# Altium project WiCL.PrjPCB
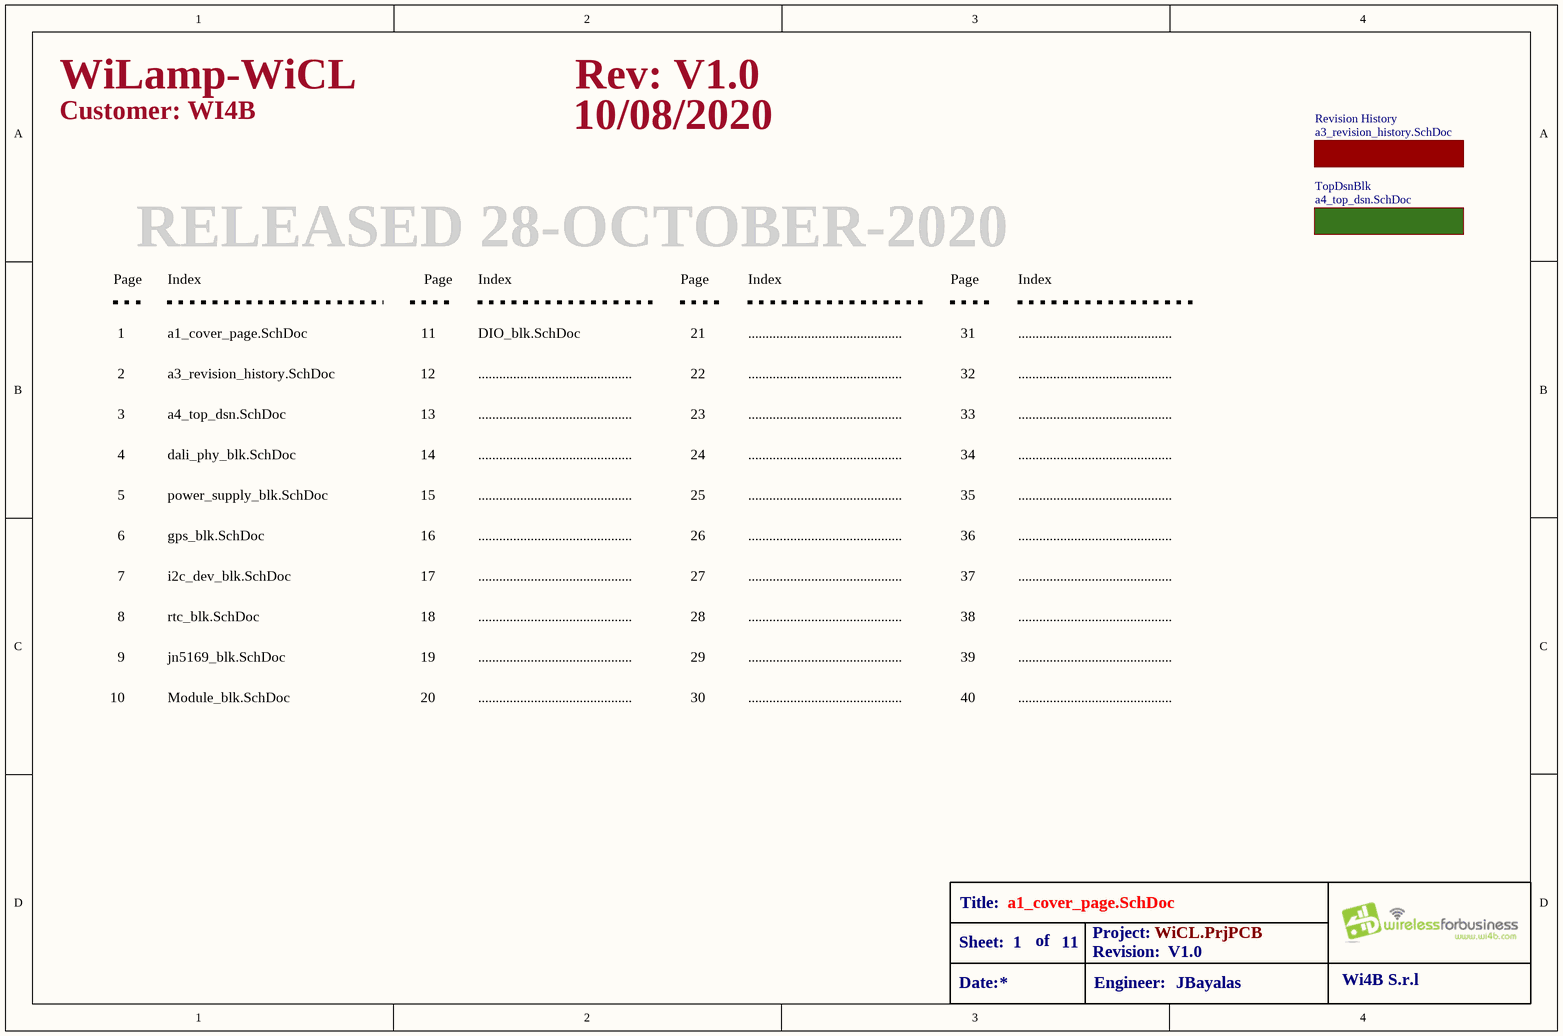
[diagram p0: a1_cover_page.SchDoc]
Engineer: AAsodisen; Revision: V1.0
11 sheets, 143 parts. Net scope: hierarchical (ports join the sheet entries above them; power ports are global).
Board file: WiCL.PcbDoc
Sheets:
  a1_cover_page.SchDoc
    TopDsnBlk = a4_top_dsn.SchDoc
      DALI_PHY = dali_phy_blk.SchDoc
      PSU = power_supply_blk.SchDoc
      I2C Devs = i2c_dev_blk.SchDoc
      GPS = gps_blk.SchDoc
      JENIC = jn5169_blk.SchDoc
        Module_blk = Module_blk.SchDoc
      RTC = rtc_blk.SchDoc
      Digital = DIO_blk.SchDoc
    Revision History = a3_revision_history.SchDoc

## Sheet a1_cover_page.SchDoc
size A4; Date: 1/11/16; CompanyName: AMTI; Engineer: JBayalas; DocumentNumber: 1; Revision: V1.0; SheetNumber: 1; SheetTotal: 11

### Sub-sheets
Revision History = a3_revision_history.SchDoc: no entries
TopDsnBlk = a4_top_dsn.SchDoc: no entries

### Notes on the sheet
- WiLamp-WiCL
- Rev: V1.0
- Customer: WI4B
- 10/08/2020
- Page
- Index
- RELEASED 28-OCTOBER-2020
- 1
- 2
- a1_cover_page.SchDoc
- a3_revision_history.SchDoc
- 11
- 12
- ............................................
- DIO_blk.SchDoc
- 21
- 22
- 31
- 32
- 3
- a4_top_dsn.SchDoc
- 13
- 23
- 33
- 4
- 5
- dali_phy_blk.SchDoc
- power_supply_blk.SchDoc
- 14
- 15
- 24
- 25
- 34
- 35
- 6
- 7
- i2c_dev_blk.SchDoc
- gps_blk.SchDoc
- 16
- 17
- 26
- 27
- 36
- 37
- 8
- rtc_blk.SchDoc
- 18
- 28
- 38
- 9
- 10
- jn5169_blk.SchDoc
- Module_blk.SchDoc
- 19
- 20
- 29
- 30
- 39
- 40
- Title:
- Sheet:
- Date:
- of
- Project:
- Revision:
- Engineer:
- Wi4B S.r.l

## Sheet a4_top_dsn.SchDoc
size A4; Date: 1/11/16; Engineer: JBayalas; DocumentNumber: 3; Revision: V1.0; SheetNumber: 3; SheetTotal: 11
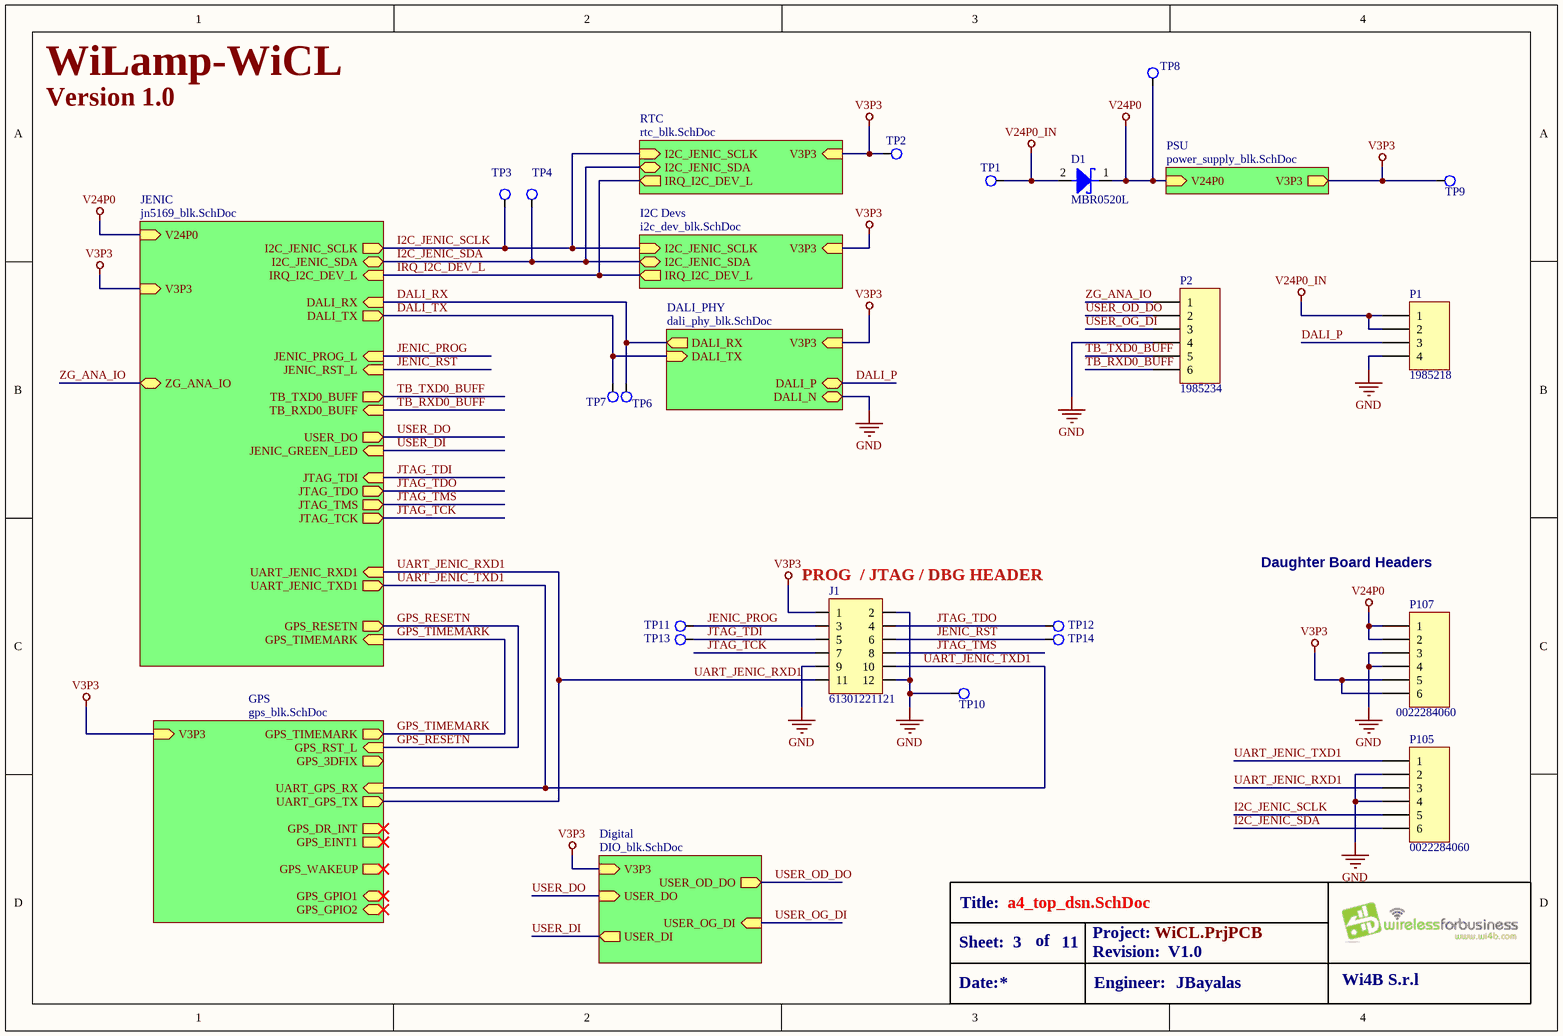
[diagram p1: a4_top_dsn.SchDoc]

### Parts
D1  MBR0520L  [SOD123]
J1  value 61301221121  [61301221121]  (hidden comment: *)
P1  1985218  [1985218 (4pin)]
P2  1985234  [1985234 (6 PIN)]
P105  0022284060  [HDR1X6]
P107  0022284060  [HDR1X6]
TP1  Test Point_2mm  [Test Point 2mm]  (value not drawn)
TP2  Test Point_2mm  [Test Point 2mm]  (value not drawn)
TP3  Test Point_2mm  [Test Point 2mm]  (value not drawn)
TP4  Test Point_2mm  [Test Point 2mm]  (value not drawn)
TP6  Test Point_2mm  [Test Point 2mm]  (value not drawn)
TP7  Test Point_2mm  [Test Point 2mm]  (value not drawn)
TP8  Test Point_3mm  [Test Point 3mm]  (value not drawn)
TP9  Test Point_3mm  [Test Point 3mm]  (value not drawn)
TP10  Test Point_3mm  [Test Point 3mm]  (value not drawn)
TP11  Test Point_3mm  [Test Point 3mm]  (value not drawn)
TP12  Test Point_3mm  [Test Point 3mm]  (value not drawn)
TP13  Test Point_3mm  [Test Point 3mm]  (value not drawn)
TP14  Test Point_3mm  [Test Point 3mm]  (value not drawn)

### Sub-sheets
DALI_PHY = dali_phy_blk.SchDoc: V3P3 (in), DALI_TX (in), DALI_RX (out), DALI_P (bidir), DALI_N (bidir)
Digital = DIO_blk.SchDoc: USER_DO (in), V3P3 (in), USER_DI (out), USER_OD_DO (out), USER_OG_DI (in)
GPS = gps_blk.SchDoc: UART_GPS_TX (out), UART_GPS_RX (in), V3P3 (in), GPS_RST_L (in), GPS_DR_INT (out), GPS_EINT1 (out), GPS_3DFIX (out), GPS_TIMEMARK (out), GPS_WAKEUP (out), GPS_GPIO1 (bidir), GPS_GPIO2 (bidir)
I2C Devs = i2c_dev_blk.SchDoc: I2C_JENIC_SDA (bidir), I2C_JENIC_SCLK (in), V3P3 (in), IRQ_I2C_DEV_L (out)
JENIC = jn5169_blk.SchDoc: V3P3 (in), JENIC_PROG_L (in), UART_JENIC_TXD1 (out), UART_JENIC_RXD1 (in), I2C_JENIC_SDA (bidir), I2C_JENIC_SCLK (out), ZG_ANA_IO (bidir), IRQ_I2C_DEV_L (in), GPS_RESETN (out), GPS_TIMEMARK (in), JENIC_RST_L (in), V24P0 (in), DALI_RX (in), DALI_TX (out), JTAG_TDI (in), JTAG_TDO (out), JTAG_TMS (out), JTAG_TCK (out), TB_RXD0_BUFF (in), TB_TXD0_BUFF (out), JENIC_GREEN_LED (in), USER_DO (out)
PSU = power_supply_blk.SchDoc: V3P3 (out), V24P0 (in)
RTC = rtc_blk.SchDoc: V3P3 (in), I2C_JENIC_SCLK (in), I2C_JENIC_SDA (bidir), IRQ_I2C_DEV_L (out)

### Nets
GND: J1.2 J1.9 J1.12 P1.4 P2.4 P105.2 P105.4 P107.3 P107.4 TP10.1 ; sheet DALI_PHY/DALI_N
V3P3: J1.1 P107.5 P107.6 TP2.1 TP9.1 ; sheet DALI_PHY/V3P3, sheet PSU/V3P3, sheet I2C Devs/V3P3, sheet GPS/V3P3, sheet JENIC/V3P3, sheet RTC/V3P3, sheet Digital/V3P3
V24P0: D1.1(cathode) P107.1 P107.2 TP8.1 ; sheet PSU/V24P0, sheet JENIC/V24P0
V24P0_IN: D1.2(anode) P1.1 P1.2 TP1.1
DALI_P: P1.3 ; sheet DALI_PHY/DALI_P
DALI_RX: TP6.1 ; sheet DALI_PHY/DALI_RX, sheet JENIC/DALI_RX
DALI_TX: TP7.1 ; sheet DALI_PHY/DALI_TX, sheet JENIC/DALI_TX
GPS_RESETN: sheet GPS/GPS_RST_L, sheet JENIC/GPS_RESETN
GPS_TIMEMARK: sheet GPS/GPS_TIMEMARK, sheet JENIC/GPS_TIMEMARK
I2C_JENIC_SCLK: P105.5 TP3.1 ; sheet I2C Devs/I2C_JENIC_SCLK, sheet JENIC/I2C_JENIC_SCLK, sheet RTC/I2C_JENIC_SCLK
I2C_JENIC_SDA: P105.6 TP4.1 ; sheet I2C Devs/I2C_JENIC_SDA, sheet JENIC/I2C_JENIC_SDA, sheet RTC/I2C_JENIC_SDA
IRQ_I2C_DEV_L: sheet I2C Devs/IRQ_I2C_DEV_L, sheet JENIC/IRQ_I2C_DEV_L, sheet RTC/IRQ_I2C_DEV_L
JENIC_PROG: J1.3 TP11.1 ; sheet JENIC/JENIC_PROG_L
JENIC_RST: J1.6 TP14.1 ; sheet JENIC/JENIC_RST_L
JTAG_TCK: J1.7 ; sheet JENIC/JTAG_TCK
JTAG_TDI: J1.5 TP13.1 ; sheet JENIC/JTAG_TDI
JTAG_TDO: J1.4 TP12.1 ; sheet JENIC/JTAG_TDO
JTAG_TMS: J1.8 ; sheet JENIC/JTAG_TMS
TB_RXD0_BUFF: P2.6 ; sheet JENIC/TB_RXD0_BUFF
TB_TXD0_BUFF: P2.5 ; sheet JENIC/TB_TXD0_BUFF
UART_JENIC_RXD1: J1.11 P105.3 ; sheet GPS/UART_GPS_TX, sheet JENIC/UART_JENIC_RXD1
UART_JENIC_TXD1: J1.10 P105.1 ; sheet GPS/UART_GPS_RX, sheet JENIC/UART_JENIC_TXD1
USER_DI: sheet JENIC/JENIC_GREEN_LED, sheet Digital/USER_DI
USER_DO: sheet JENIC/USER_DO, sheet Digital/USER_DO
USER_OD_DO: P2.2 ; sheet Digital/USER_OD_DO
USER_OG_DI: P2.3 ; sheet Digital/USER_OG_DI
ZG_ANA_IO: P2.1 ; sheet JENIC/ZG_ANA_IO

### Notes on the sheet
- Version 1.0
- WiLamp-WiCL
- (near J1) PROG  / JTAG / DBG HEADER
- Daughter Board Headers
- Title:
- Sheet:
- Date:
- of
- Project:
- Revision:
- Engineer:
- Wi4B S.r.l

### Library data of the parts
D1 = MBR0520L: DIODE SCHOTTKY 20V 0.5A SOD123; Manufacturer: Fairchild Semiconductor; Current - Average Rectified (Io): 500mA; Voltage - Forward (Vf) (Max) @ If: 385mV @ 500mA; Speed: Fast Recovery =< 500ns, > 200mA (Io); Current - Reverse Leakage @ Vr: 250µA @ 20V; Capacitance: 2.2µF; Tolerance: ±20%; Voltage - Rated: 100V; Temperature Coefficient: X7S; Supplier 1: Digi-Key; RoHS: RoHS Compliant; Category: Discrete Semiconductor Products; Stock 1: 251227; Pricing 1: 1=0.26, 10=0.232, 25=0.1668, 100=0.1297, 250=0.08152, 500=0.06946, 1000=0.04732 (GBP); Packaging: Cut Tape (CT); Diode Type: Schottky; Voltage - DC Reverse (Vr) (Max): 20V; Reverse Recovery Time (trr): -; Capacitance @ Vr, F: -; Mounting Type: Surface Mount; Package / Case: SOD-123; Supplier Device Package: SOD-123; Operating Temperature - Junction: -65°C ~ 125°C; ComponentLink1URL: http://www.fairchildsemi.com/datasheets/MB/MBR0520L.pdf; ComponentLink1Description: http://www.fairchildsemi.com/datasheets/MB/MBR0520L.pdf; Supplier Part Number 1: MBR0520LCT-ND; Supplier 2: Digi-Key; Stock 2: 9462; Pricing 2: 1=0.84, 10=0.804, 100=0.39, 250=0.324, 500=0.294, 1000=0.27 (USD); Operating Temperature: -55°C ~ 125°C; Applications: Automotive; Ratings: AEC-Q200; Size / Dimension: 0.126" L x 0.063" W (3.20mm x 1.60mm); Height - Seated (Max): -; Thickness (Max): 0.071" (1.80mm); Lead Spacing: -; Features: -; Lead Style: -; ComponentLink2URL: https://product.tdk.com/info/en/catalog/datasheets/mlcc_automotive_midvoltage_en.pdf; ComponentLink2Description: https://product.tdk.com/info/en/catalog/datasheets/mlcc_automotive_midvoltage_en.pdf; Manufacturer Part Number: MBR0520L
J1 = 61301221121: CONN HEADER VERT 12POS 2.54MM; MFT: Wurth Electronics; MPN: 61301221121; TYPE: TH; RATING: *; LOAD: *
P1 = 1985218: Fixed Terminal Blocks PTSA 1.5/4-3.5-Z; MFT: Phoenix Contact; TYPE: Through Hole; VALUE: 1985218; MPN: 1985218
P2 = 1985234: TERM BLOCK PCB 6POS 3.5MM GREEN; MFT: Phoenix Contact; TYPE: Through Hole; VALUE: 1985234; MPN: 1985234
P105 P107 = 0022284060: CONN HEADER 6POS .100 VERT TIN; MFT: Molex Inc; FUNCTION: TOP; TYPE: TH; VALUE: 0022284060; RATING: *; LOAD: *; MPN: 0022284060
TP1-TP4 TP6 TP7 = Test Point_2mm: Test Point 2mm
TP8-TP14 = Test Point_3mm: Test Point 3mm

## Sheet dali_phy_blk.SchDoc
size A4; Engineer: JBayalas; DocumentNumber: 4; Revision: V1.0; SheetNumber: 4; SheetTotal: 11; Rule: PcbType=ProtelPcb
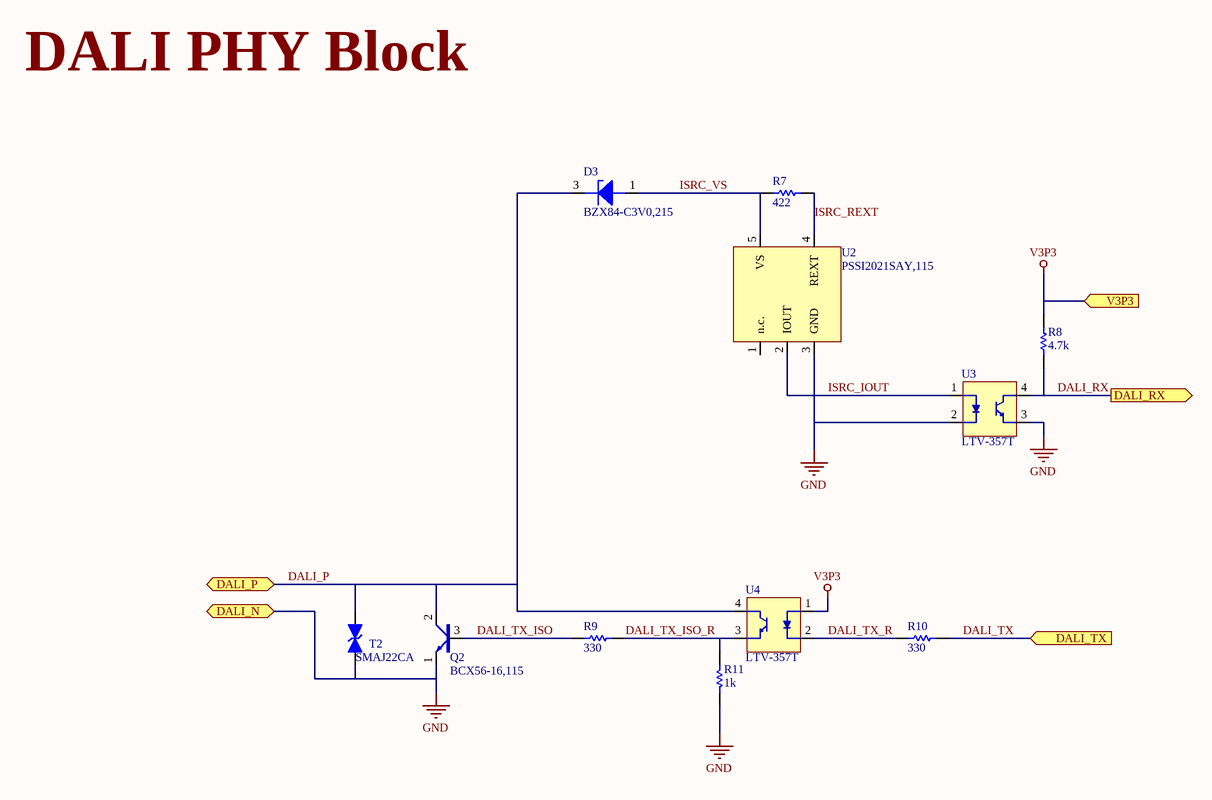
[diagram p2: dali_phy_blk.SchDoc]

### Parts
D3  BZX84-C3V0,215  [SOT-23(TO-236AB)]
Q2  BCX56-16,115  [SOT 89-3]
R7  value 422  [R0402]  (hidden comment: ERJ-2RKF4220X)
R8  value 4.7k  [R0402]  (hidden comment: RT0402FRE074K7L)
R9  value 330  [R0402]  (hidden comment: CRCW0402330RFKED)
R10  value 330  [R0402]  (hidden comment: CRCW0402330RFKED)
R11  value 1k  [R0402]  (hidden comment: MCS04020C1001FE000)
T2  SMAJ22CA  [DO-214AC]
U2  PSSI2021SAY,115  [SOT353]
U3  LTV-357T  [4SMD(gull wing)]
U4  LTV-357T  [4SMD(gull wing)]

### Ports
DALI_N (bidir), DALI_P (bidir), DALI_RX (out), DALI_TX (in), V3P3 (in)

### Nets
GND: Q2.1(emitter) R11.1 T2.2(K) U2.3(GND) U3.2(Cathode) U3.3(Emitter) ; port DALI_N
V3P3: R8.2 U4.1(Anode) ; port V3P3
DALI_P: D3.3(K) Q2.2(collector) T2.1(A) U4.4(Collector) ; port DALI_P
DALI_RX: R8.1 U3.4(Collector) ; port DALI_RX
DALI_TX: R10.2 ; port DALI_TX
DALI_TX_ISO: Q2.3(base) R9.1
DALI_TX_ISO_R: R9.2 R11.2 U4.3(Emitter)
DALI_TX_R: R10.1 U4.2(Cathode)
ISRC_IOUT: U2.2(IOUT) U3.1(Anode)
ISRC_REXT: R7.2 U2.4(REXT)
ISRC_VS: D3.1(A) R7.1 U2.5(VS)

Not connected (* = marked no-connect by the designer): U2 1(n.c.)

### Notes on the sheet
- DALI PHY Block
- Title:
- Sheet:
- Date:
- of
- Project:
- Revision:
- Engineer:
- Wi4B S.r.l

### Library data of the parts
D3 = BZX84-C3V0,215: DIODE ZENER 3V 250MW TO236AB; Manufacturer: NXP Semiconductors; Tolerance: ±5%; Impedance (Max) (Zzt): 95 Ohm; Current - Reverse Leakage @ Vr: 10µA @ 1V; Voltage - Forward (Vf) (Max) @ If: 900mV @ 10mA; Supplier 1: Digi-Key; RoHS: RoHS Compliant; Category: Discrete Semiconductor Products; Stock 1: 18717; Pricing 1: 1=0.16, 10=0.149, 25=0.1352, 100=0.0973, 250=0.05732, 500=0.04756, 1000=0.03245 (USD); Packaging: Cut Tape (CT); Voltage - Zener (Nom) (Vz): 3V; Power - Max: 250mW; Operating Temperature: -65°C ~ 150°C; Mounting Type: Surface Mount; Package / Case: TO-236-3, SC-59, SOT-23-3; Supplier Device Package: SOT-23 (TO-236AB); ComponentLink1URL: http://www.nxp.com/documents/data_sheet/BZX84_SER.pdf; ComponentLink1Description: http://www.nxp.com/documents/data_sheet/BZX84_SER.pdf; Supplier Part Number 1: 568-6326-1-ND; Manufacturer Part Number: BZX84-C3V0,215
Q2 = BCX56-16,115: TRANS NPN MED 1A 80V SOT89; Manufacturer: NXP Semiconductors; Vce Saturation (Max) @ Ib, Ic: 500mV @ 50mA, 500mA; DC Current Gain (hFE) (Min) @ Ic, Vce: 100 @ 150mA, 2V; Power - Max: 1.25W; Frequency - Transition: 180MHz; Supplier 1: Digi-Key; RoHS: RoHS Compliant; Category: Discrete Semiconductor Products; Stock 1: 23673; Pricing 1: 1=0.58, 10=0.406, 25=0.3332, 100=0.2664, 250=0.19404, 500=0.15758 (USD); Packaging: Cut Tape (CT); Transistor Type: NPN; Current - Collector (Ic) (Max): 1A; Voltage - Collector Emitter Breakdown (Max): 80V; Current - Collector Cutoff (Max): -; Mounting Type: Surface Mount; Package / Case: TO-243AA; Supplier Device Package: SOT-89-3; ComponentLink1URL: http://media.digikey.com/pdf/Data%20Sheets/NXP%20PDFs/BC639,BCP56,BCX56.pdf; ComponentLink1Description: http://media.digikey.com/pdf/Data%20Sheets/NXP%20PDFs/BC639,BCP56,BCX56.pdf; Supplier Part Number 1: 568-1642-1-ND; Manufacturer Part Number: BCX56-16,115
R7 = ERJ-2RKF4220X: RES SMD 422 OHM 1% 1/10W 0402; MFT: Panasonic Electronic Components; MPN: ERJ-2RKF4220X; TYPE: SMD; LOAD: *; RATING: 1/10W; APN: *
R8 = RT0402FRE074K7L: RES SMD 4.7K OHM 1% 1/16W 0402; MFT: Yageo; MPN: RT0402FRE074K7L; TYPE: SMD; LOAD: *; RATING: 1/16W; APN: *
R9 R10 = CRCW0402330RFKED: RES SMD 330 OHM 1% 1/16W 0402; MFT: Vishay Dale; MPN: CRCW0402330RFKED; TYPE: SMD; RATING: 1/16W; DNP: *
R11 = MCS04020C1001FE000: RES SMD 1K OHM 1% 1/10W 0402; MFT: Vishay Beyschlag; MPN: MCS04020C1001FE000; TYPE: SMD; RATING: 1/10W; DNP: *
T2 = SMAJ22CA: TVS Diodes - Transient Voltage Suppressors 22Vr 400W 11.3A 5% BiDirectional; MFT: Littelfuse; TYPE: SMD/SMT; RATING: 22 V; VALUE: SMAJ22CA; MPN: SMAJ22CA
U2 = PSSI2021SAY,115: NXP - PSSI2021SAY,115 - IC, CURRENT REGULATOR, 75V, 50MA, 5-SOT-353, FULL REEL; Power Dissipation Pd: 335; No. of Pins: 5; Supplier 1: Newark; Manufacturer: NXP; RoHS: YES; Stock 1: 3000; Pricing 1: 3000=0.233, 6000=0.216, 15000=0.209, 30000=0.201, 75000=0.197, 150000=0.192 (USD); Forward Current If: -; Forward Voltage: -; Forward Current If(AV): -; Current Regulator Case Style: SOT-353; Packaging: Tape & Reel; ComponentLink1URL: http://www.farnell.com/datasheets/667515.pdf; ComponentLink1Description: http://www.farnell.com/datasheets/667515.pdf; Supplier Part Number 1: 70R7980; Manufacturer Part Number: PSSI2021SAY,115
U3 U4 = LTV-357T: OPTOISOLATOR 3.75KV TRANS 4-SOP; MFT: Lite-On Inc.; TYPE: SMD; RATING: 3.75KV; VALUE: LTV-357T; LOAD: *; MPN: LTV-357T

## Sheet power_supply_blk.SchDoc
size A4; Date: 1/11/2016; Engineer: JBayalas; DocumentNumber: 5; Revision: V1.0; SheetNumber: 5; SheetTotal: 11
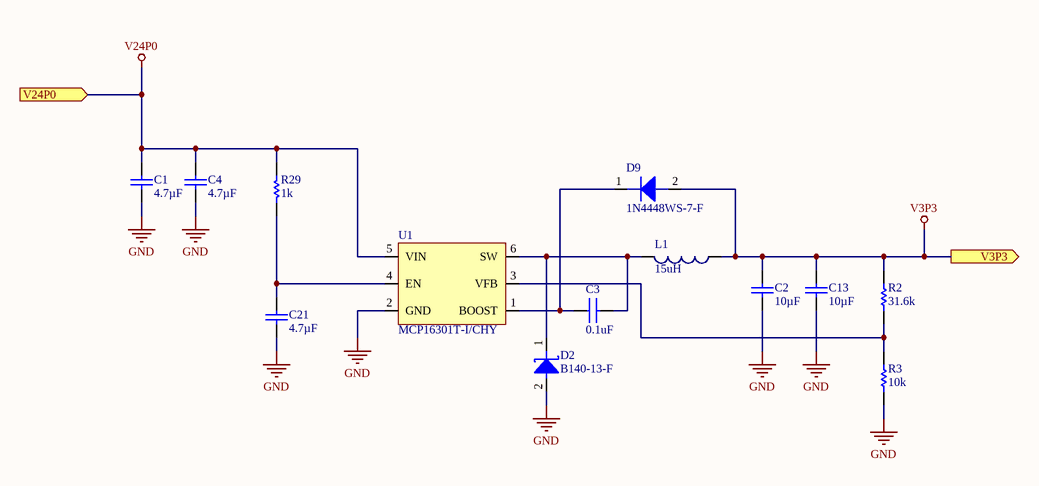
[diagram p3: power_supply_blk.SchDoc]

### Parts
C1  value 4.7µF  [C1210]  (hidden comment: *)
C2  value 10µF  [C0805]  (hidden comment: *)
C3  value 0.1uF  [C0603]  (hidden comment: *)
C4  value 4.7µF  [C1210]  (hidden comment: *)
C13  value 10µF  [C0805]  (hidden comment: *)
C21  value 4.7µF  [C1210]  (hidden comment: *)
D2  value B140-13-F  [DO-214AC, SMA]  (hidden comment: *)
D9  1N4448WS-7-F  [SOD-323]
L1  value 15uH  [MSS6132-153MLC]  (hidden comment: *)
R2  value 31.6k  [R0603]  (hidden comment: *)
R3  value 10k  [R0603]  (hidden comment: ERJ-3EKF1002V)
R29  value 1k  [R1206]  (hidden comment: *)
U1  MCP16301T-I/CHY  [SOT-23-6]

### Ports
V3P3 (out), V24P0 (in)

### Nets
GND: C1.2 C2.2 C4.2 C13.2 C21.2 D2.2(anode) R3.1 U1.2(GND)
V3P3: C2.1 C13.1 D9.2(ANODE) L1.2 R2.2 ; port V3P3
V24P0: C1.1 C4.1 R29.2 U1.5(VIN) ; port V24P0
NetC3_1: C3.1 D9.1(CATHODE) U1.1(BOOST)
NetC3_2: C3.2 D2.1(cathode) L1.1 U1.6(SW)
NetC21_1: C21.1 R29.1 U1.4(EN)
NetR2_1: R2.1 R3.2 U1.3(VFB)

### Notes on the sheet
- Title:
- Sheet:
- Date:
- of
- Project:
- Revision:
- Engineer:
- Wi4B S.r.l

### Library data of the parts
C1 C4 C21 = UMK325B7475KM-T: CAP CER 4.7UF 50V X7R 1210; MFT: Taiyo Yuden; TYPE: SMD; MPN: UMK325B7475KM-T; LOAD: *; RATING: 50V
C2 C13 = JMK212B7106KG-T: CAP CER 10UF 6.3V X7R 0805; MFT: Taiyo Yuden; TYPE: SMD; MPN: JMK212B7106KG-T; LOAD: *; RATING: 6.3V
C3 = 06033C104JAT2A: CAP CER 0.1UF 25V X7R 0603; MFT: Kyocera AVX; TYPE: SMD; MPN: 06033C104JAT2A; RATING: 25V; LOAD: *
D2 = B140-13-F: DIODE SCHOTTKY 40V 1A SMA; MFT: Diodes; TYPE: SMD; MPN: B140-13-F; RATING: 40V; LOAD: *
D9 = 1N4448WS-7-F: DIODE GEN PURP 75V 250MA SOD323; MFT: Diodes; TYPE: SMD; MPN: 1N4448WS-7-F; LOAD: *; RATING: 75V; VALUE: 1N4448WS-7-F
L1 = MSS6132-153MLC: Fixed Inductors MSS6132 AEC-Q200 15 uH 20 % 2.2 A; MFT: Coilcraft; TYPE: SMD; MPN: MSS6132-153MLC; RATING: *; LOAD: *
R2 = ERJ-3EKF3162V: RES SMD 31.6K OHM 1% 1/10W 0603; MFT: Panasonic; MPN: ERJ-3EKF3162V; TYPE: SMD; RATING: 1/10W; LOAD: *
R3 = ERJ-3EKF1002V: RES SMD 10K OHM 1% 1/10W 0603; MFT: Panasonic Electronic Components; RATING: 0.1W, 1/10W; MPN: ERJ-3EKF1002V; TYPE: Surface Mount
R29 = RNCP1206FTD1K00: RES 1K OHM 1% 1/2W 1206; MFT: Stackpole Electronics; MPN: RNCP1206FTD1K00; TYPE: SMD; RATING: 1/2W; LOAD: *
U1 = MCP16301T-I/CHY: IC REG BUCK ADJ 0.6A SOT23-6; MFT: Microchip; MPN: MCP16301T-I/CHY; RATING: 0.6A; LOAD: *; TYPE: SMD; VALUE: MCP16301T-I/CHY

## Sheet i2c_dev_blk.SchDoc
size A4; Engineer: JBayalas; DocumentNumber: 7; Revision: V1.0; SheetNumber: 7; SheetTotal: 11
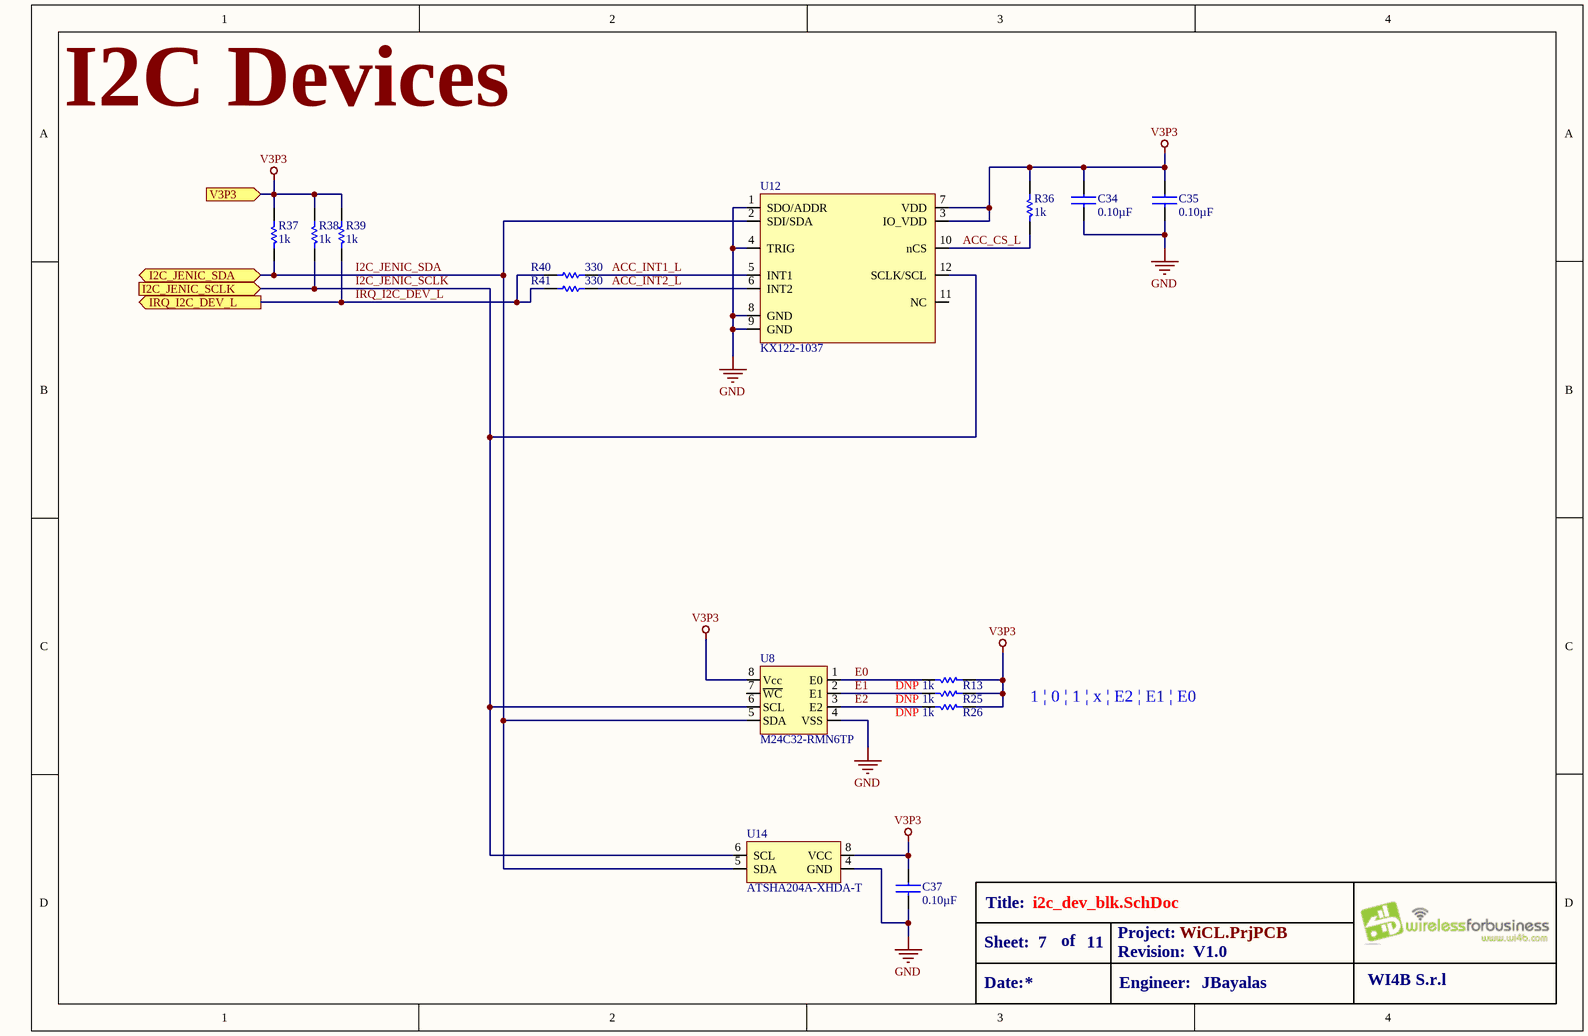
[diagram p4: i2c_dev_blk.SchDoc]

### Parts
C34  value 0.10µF  [C0402]  (hidden comment: GRM155R71H104ME14D)
C35  value 0.10µF  [C0402]  (hidden comment: GRM155R71H104ME14D)
C37  value 0.10µF  [C0402]  (hidden comment: GRM155R71H104ME14D)
R13  value 1k  [R0402]  (hidden comment: MCS04020C1001FE000)
R25  value 1k  [R0402]  (hidden comment: MCS04020C1001FE000)
R26  value 1k  [R0402]  (hidden comment: MCS04020C1001FE000)
R36  value 1k  [R0402]  (hidden comment: MCS04020C1001FE000)
R37  value 1k  [R0402]  (hidden comment: MCS04020C1001FE000)
R38  value 1k  [R0402]  (hidden comment: MCS04020C1001FE000)
R39  value 1k  [R0402]  (hidden comment: MCS04020C1001FE000)
R40  value 330  [R0402]  (hidden comment: CRCW0402330RFKED)
R41  value 330  [R0402]  (hidden comment: CRCW0402330RFKED)
U8  M24C32-RMN6TP  [8-SOIC]
U12  KX122-1037  [KX122-1037]
U14  ATSHA204A-XHDA-T  [TSSOP-8 (wide Body)]

### Ports
I2C_JENIC_SCLK (in), I2C_JENIC_SDA (bidir), IRQ_I2C_DEV_L (out), V3P3 (in)

### Nets
GND: C34.2 C35.2 C37.2 U8.4(VSS) U12.1(SDO/ADDR) U12.4(TRIG) U12.8(GND) U12.9(GND) U14.4(GND)
V3P3: C34.1 C35.1 C37.1 R13.1 R25.1 R26.1 R36.2 R37.2 R38.2 R39.2 U8.8(Vcc) U12.3(IO_VDD) U12.7(VDD) U14.8(VCC) ; port V3P3
ACC_CS_L: R36.1 U12.10(nCS)
ACC_INT1_L: R40.1 U12.5(INT1)
ACC_INT2_L: R41.1 U12.6(INT2)
E0: R13.2 U8.1(E0)
E1: R25.2 U8.2(E1)
E2: R26.2 U8.3(E2)
I2C_JENIC_SCLK: R38.1 U8.6(SCL) U12.12(SCLK/SCL) U14.6(SCL) ; port I2C_JENIC_SCLK
I2C_JENIC_SDA: R37.1 U8.5(SDA) U12.2(SDI/SDA) U14.5(SDA) ; port I2C_JENIC_SDA
IRQ_I2C_DEV_L: R39.1 R40.2 R41.2 ; port IRQ_I2C_DEV_L

Not connected (* = marked no-connect by the designer): U8 7(~{WC}); U12 11(NC)

### Notes on the sheet
- I2C Devices
- 1 | 0 | 1 | x | E2 | E1 | E0
- Title:
- Sheet:
- Date:
- of
- Project:
- Revision:
- Engineer:
- WI4B S.r.l

### Library data of the parts
C34 C35 C37 = GRM155R71H104ME14D: CAP CER 0.1UF 50V X7R 0402; MFT: Murata Electronics North America; TYPE: SMD; MPN: GRM155R71H104ME14D; RATING: 50V; DNP: *
R13 R25 R26 R36-R39 = MCS04020C1001FE000: as R11 on sheet dali_phy_blk; MPN: MCS04020C1001FE000; TYPE: SMD; RATING: 1/10W
  R13 R25 R26: DNP: DNP
  R36-R39: DNP: *
R40 R41 = CRCW0402330RFKED: as R9 on sheet dali_phy_blk; MPN: CRCW0402330RFKED; TYPE: SMD; RATING: 1/16W; DNP: *
U8 = M24C32-RMN6TP: IC EEPROM 32KBIT 400KHZ 8SO; MFT: STMicroelectronics; VALUE: M24C32-RMN6TP; RATING: *; TYPE: SMD; LOAD: *; MPN: M24C32-RMN6TP
U12 = KX122-1037: ACCELEROMETER 2-8G I2C/SPI 12LGA; MFT: Kionix Inc.; LOAD: *; RATING: *; TYPE: SMD; VALUE: KX122-1037; MPN: KX122-1037
U14 = ATSHA204A-XHDA-T: IC CRYPTO 4.5KB I2C; MFT: Microchip Technology; LOAD: *; TYPE: SMD; RATING: *; VALUE: ATSHA204A-XHDA-T; MPN: ATSHA204A-XHDA-T

## Sheet gps_blk.SchDoc
size A4; Engineer: JBayalas; DocumentNumber: 6; Revision: V1.0; SheetNumber: 6; SheetTotal: 11
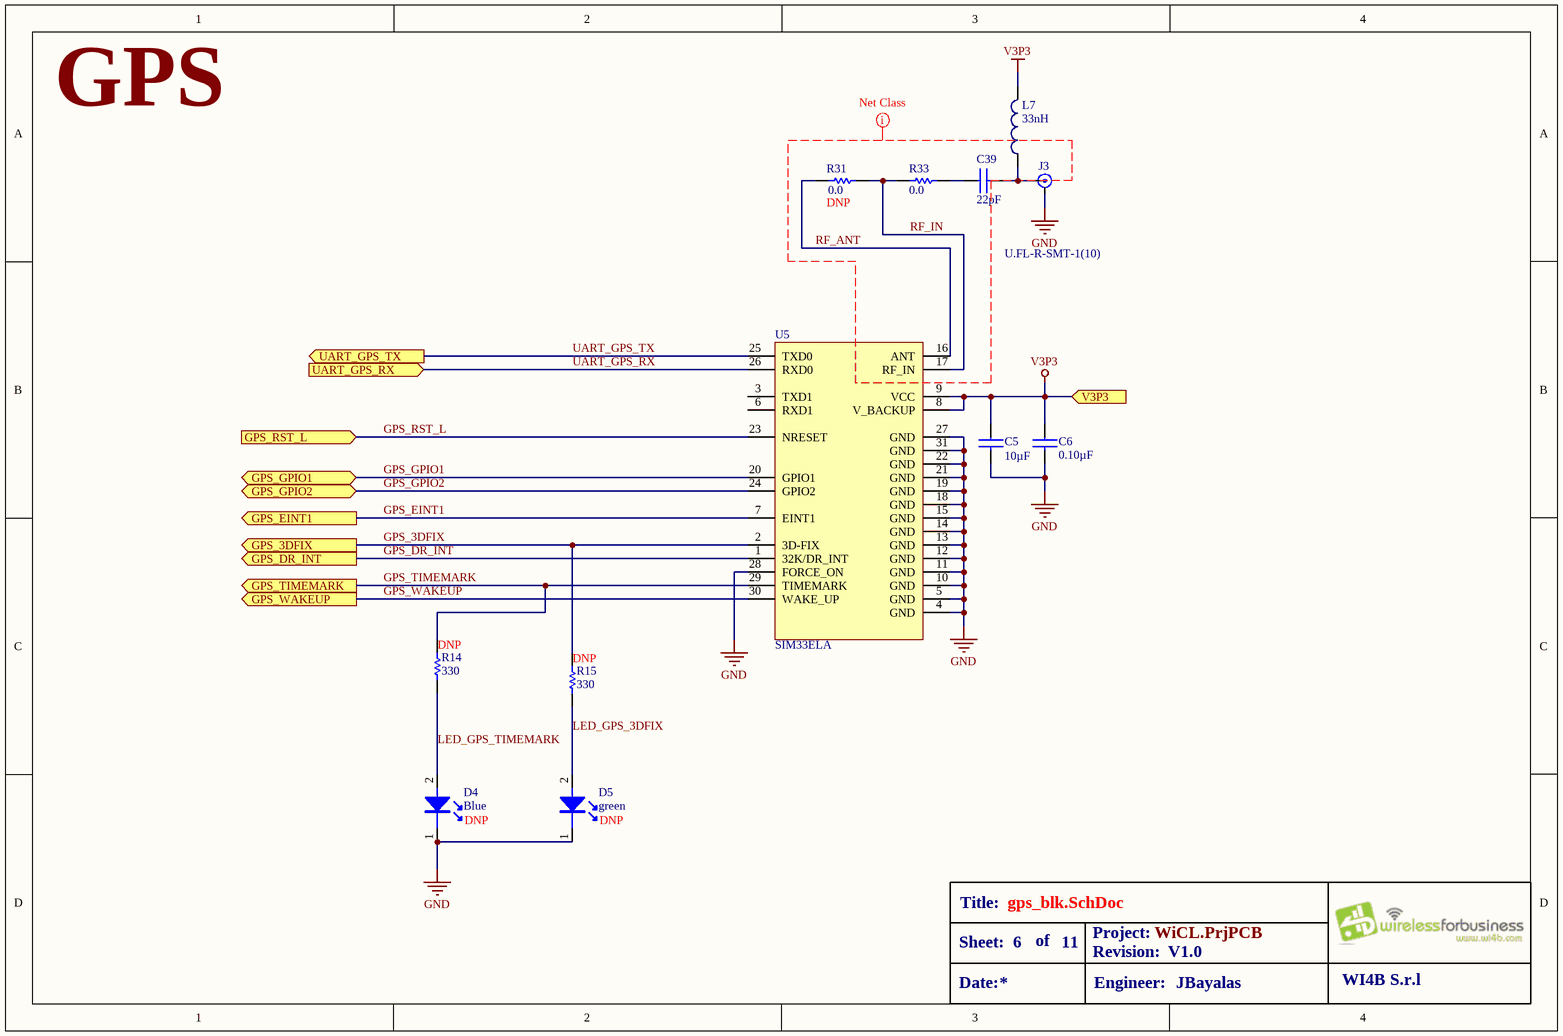
[diagram p5: gps_blk.SchDoc]

### Parts
C5  value 10µF  [C1206]  (hidden comment: GRM31CR71C106KAC7L)
C6  value 0.10µF  [C0402]  (hidden comment: GRM155R71H104ME14D)
C39  value 22pF  [C0402]  (hidden comment: GRM1555C1H220JA01J)
D4  value Blue  LOAD: DNP  [LED0402(BLUE)]  (hidden comment: *)
D5  value green  LOAD: DNP  [LED0402(GREEN)]  (hidden comment: *)
J3  U.FL-R-SMT-1(10)  [U.FL-R-SMT-1(10)]
L7  value 33nH  [0603 INDUCTOR]  (hidden comment: LQP18MN33NG02D)
R14  value 330  [R0402]  (hidden comment: CRCW0402330RFKED)
R15  value 330  [R0402]  (hidden comment: CRCW0402330RFKED)
R31  value 0.0  LOAD: DNP  [R0402]  (hidden comment: MCS04020Z0000ZE000)
R33  value 0.0  [R0402]  (hidden comment: MCS04020Z0000ZE000)
U5  SIM33ELA  [SIM33ELA]

### Ports
GPS_3DFIX (out), GPS_DR_INT (out), GPS_EINT1 (out), GPS_GPIO1 (bidir), GPS_GPIO2 (bidir), GPS_RST_L (in), GPS_TIMEMARK (out), GPS_WAKEUP (out), UART_GPS_RX (in), UART_GPS_TX (out), V3P3 (in)

### Nets
GND: C5.2 C6.2 D4.1 D5.1 J3.2(GND) U5.4(GND) U5.5(GND) U5.10(GND) U5.11(GND) U5.12(GND) U5.13(GND) U5.14(GND) U5.15(GND) U5.18(GND) U5.19(GND) U5.21(GND) U5.22(GND) U5.27(GND) U5.28(FORCE_ON) U5.31(GND)
V3P3: C5.1 C6.1 L7.1 U5.8(V_BACKUP) U5.9(VCC) ; port V3P3
GPS_3DFIX: R15.2 U5.2(3D-FIX) ; port GPS_3DFIX
GPS_DR_INT: U5.1(32K/DR_INT) ; port GPS_DR_INT
GPS_EINT1: U5.7(EINT1) ; port GPS_EINT1
GPS_GPIO1: U5.20(GPIO1) ; port GPS_GPIO1
GPS_GPIO2: U5.24(GPIO2) ; port GPS_GPIO2
GPS_RST_L: U5.23(NRESET) ; port GPS_RST_L  [project net GPS_RESETN]
GPS_TIMEMARK: R14.2 U5.29(TIMEMARK) ; port GPS_TIMEMARK
GPS_WAKEUP: U5.30(WAKE_UP) ; port GPS_WAKEUP
LED_GPS_3DFIX: D5.2 R15.1
LED_GPS_TIMEMARK: D4.2 R14.1
RF_ANT: R31.1 U5.16(ANT)
RF_IN: R31.2 R33.1 U5.17(RF_IN)
UART_GPS_RX: U5.26(RXD0) ; port UART_GPS_RX  [project net UART_JENIC_TXD1]
UART_GPS_TX: U5.25(TXD0) ; port UART_GPS_TX  [project net UART_JENIC_RXD1]
NetC39_1: C39.1 R33.2
NetC39_2: C39.2 J3.1(SIGNAL) L7.2

Not connected (* = marked no-connect by the designer): U5 3(TXD1) 6(RXD1)

### Layout directives
net class 50 OHMS: RF_ANT, RF_IN

### Notes on the sheet
- GPS
- Title:
- Sheet:
- Date:
- of
- Project:
- Revision:
- Engineer:
- WI4B S.r.l

### Library data of the parts
C5 = GRM31CR71C106KAC7L: CAP CER 10UF 16V X7R 1206; MFT: Murata Electronics North America; TYPE: SMD; MPN: GRM31CR71C106KAC7L; RATING: 16V; DNP: *
C6 = GRM155R71H104ME14D: as C34 on sheet i2c_dev_blk; MPN: GRM155R71H104ME14D; RATING: 50V; DNP: *
C39 = GRM1555C1H220JA01J: CAP CER 22PF 50V NP0 0402; MFT: Murata Electronics North America; TYPE: SMD; FUNCTION: GPS; MPN: GRM1555C1H220JA01J; RATING: 50V
D4 = VLMB1500-GS08: LED BLUE 0402 SMD; MFT: Vishay Semiconductor Opto Division; MPN: VLMB1500-GS08; TYPE: SMD; RATING: *
D5 = XZVG68W-2: LED GREEN CLEAR CHIP SMD; MFT: SunLED; MPN: XZVG68W-2; TYPE: SMD; RATING: *
J3 = U.FL-R-SMT-1(10): CONN UMC JACK STR 50 OHM SMD; MFT: Hirose Electric Co Ltd; FUNCTION: GPS; MPN: U.FL-R-SMT-1(10)
L7 = LQP18MN33NG02D: FIXED IND 33NH 100MA 2.8 OHM SMD; MFT: Murata Electronics North America; FUNCTION: GPS; MPN: LQP18MN33NG02D; TYPE: SMD; RATING: 100MA 2.8 OHM
R14 R15 = CRCW0402330RFKED: as R9 on sheet dali_phy_blk; MPN: CRCW0402330RFKED; TYPE: SMD; RATING: 1/16W; DNP: DNP
R31 R33 = MCS04020Z0000ZE000: RES SMD 0.0OHM JUMPER 1/10W 0402; MFT: Vishay Beyschlag; RATING: 0.1W; MPN: MCS04020Z0000ZE000; TYPE: Surface Mount
U5 = SIM33ELA: A-GPS receiver, with built-in Antenna; MFT: SIMCom; VALUE: SIM33ELA; MPN: SIM33ELA

## Sheet jn5169_blk.SchDoc
size A4; Date: 1/11/2016; Engineer: JBayalas; DocumentNumber: 9; Revision: V1.0; SheetNumber: 9; SheetTotal: 11
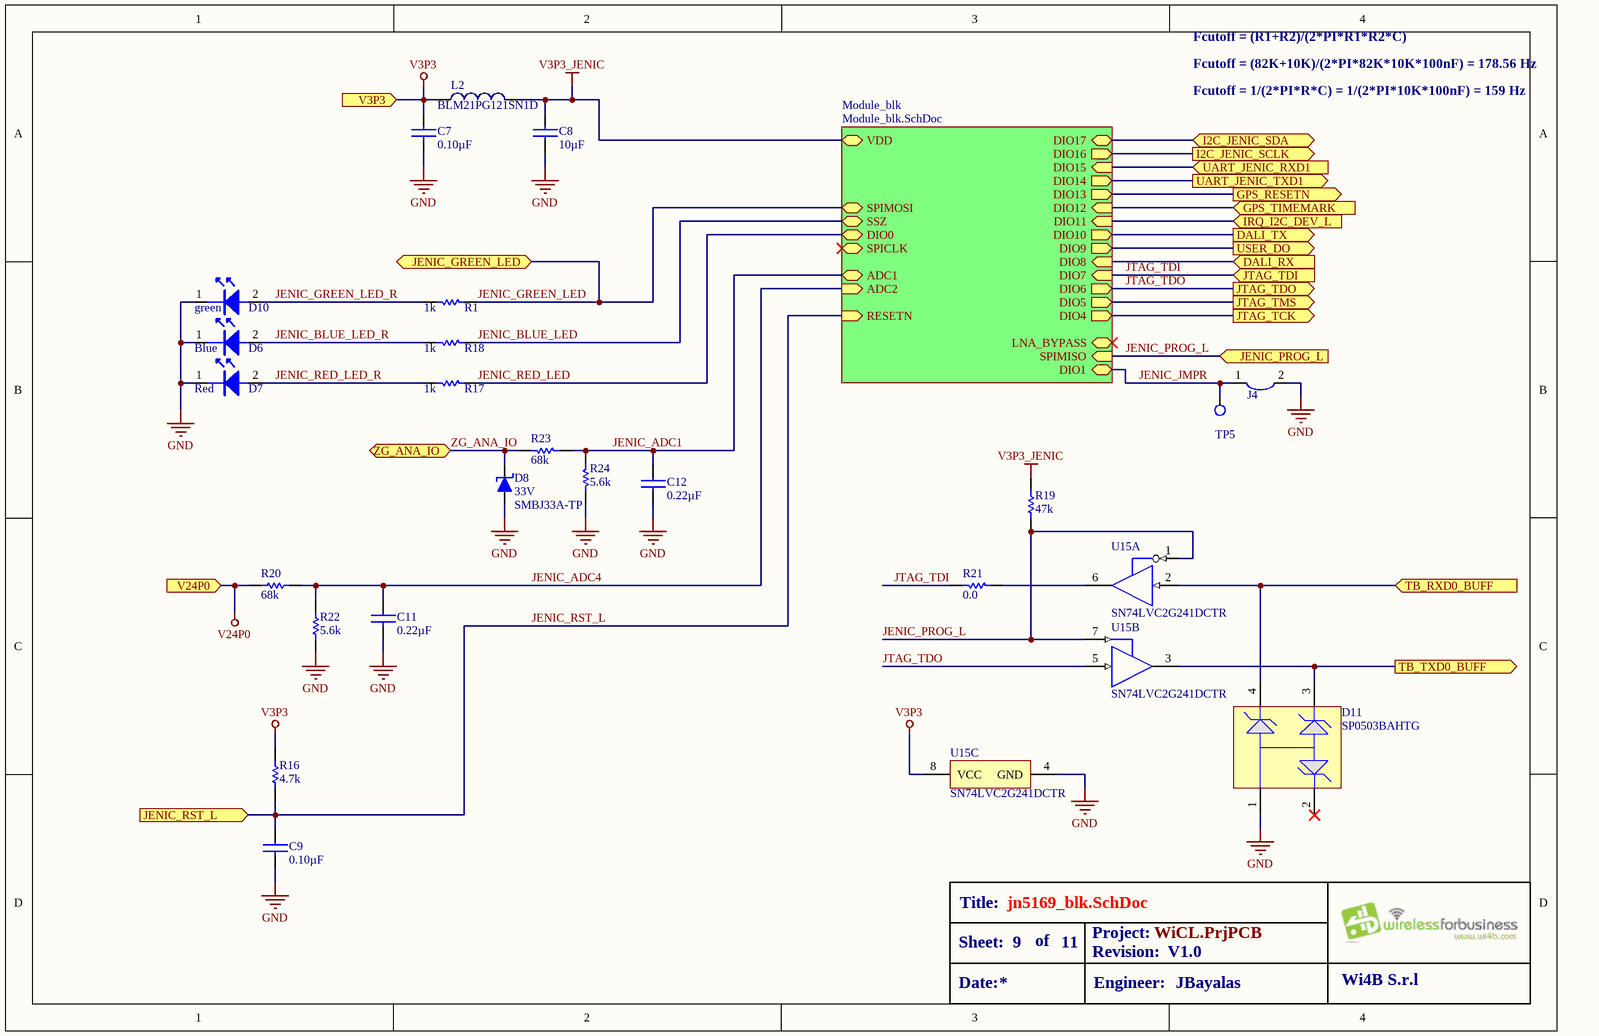
[diagram p6: jn5169_blk.SchDoc]

### Parts
C7  value 0.10µF  [C0402]  (hidden comment: GRM155R71H104ME14D)
C8  value 10µF  [C1206]  (hidden comment: GRM31CR71C106KAC7L)
C9  value 0.10µF  [C0402]  (hidden comment: GRM155R71H104ME14D)
C11  value 0.22µF  [C0603]  (hidden comment: GCM188R71H224KA64D)
C12  value 0.22µF  [C0603]  (hidden comment: GCM188R71H224KA64D)
D6  value Blue  [LED0402(BLUE)]  (hidden comment: VLMB1500-GS08)
D7  value Red  [LED0402(RED)]  (hidden comment: VLMS1500-GS08)
D8  RATING: 33V  [DO-214AA, SMB]  (hidden comment: SMBJ33A-TP)
D10  value green  [LED0402(GREEN)]  (hidden comment: XZVG68W-2)
D11  SP0503BAHTG  [LFUS-SOT143-4_V]
J4  0603 Jumper  [0603 Jumper]  (value not drawn)
L2  BLM21PG121SN1D  [0805 INDUCTOR]
R1  value 1k  [R0402]  (hidden comment: MCS04020C1001FE000)
R16  value 4.7k  [R0402]  (hidden comment: MCS04020C4701FE000)
R17  value 1k  [R0402]  (hidden comment: MCS04020C1001FE000)
R18  value 1k  [R0402]  (hidden comment: MCS04020C1001FE000)
R19  value 47k  [R0402]  (hidden comment: RC0402FR-0747KL)
R20  value 68k  [R0603]  (hidden comment: ERA-3AEB683V)
R21  value 0.0  [R0402]  (hidden comment: *)
R22  value 5.6k  [R0603]  (hidden comment: ERA-3AEB562V)
R23  value 68k  [R0603]  (hidden comment: ERA-3AEB683V)
R24  value 5.6k  [R0603]  (hidden comment: ERA-3AEB562V)
TP5  Test Point_2mm  [Test Point 2mm]  (value not drawn)
U15  SN74LVC2G241DCTR  [DCT0008A_L]  (parts A,B,C of 3)

### Sub-sheets
Module_blk = Module_blk.SchDoc: ADC1 (bidir), SPICLK (bidir), SPIMISO (in), SPIMOSI (bidir), SSZ (bidir), DIO0 (bidir), DIO1 (bidir), LNA_BYPASS (bidir), VDD (bidir), DIO10 (out), DIO9 (out), DIO8 (in), DIO7 (in), DIO6 (out), DIO5 (out), DIO4 (out), DIO17 (bidir), DIO16 (out), DIO15 (in), DIO14 (out), RESETN (in), DIO13 (out), DIO12 (in), DIO11 (in), ADC2 (in)

### Ports
DALI_RX (in), DALI_TX (out), GPS_RESETN (out), GPS_TIMEMARK (in), I2C_JENIC_SCLK (out), I2C_JENIC_SDA (bidir), IRQ_I2C_DEV_L (in), JENIC_GREEN_LED (bidir), JENIC_PROG_L (in), JENIC_RST_L (in), JTAG_TCK (out), JTAG_TDI (in), JTAG_TDO (out), JTAG_TMS (out), TB_RXD0_BUFF (in), TB_TXD0_BUFF (out), UART_JENIC_RXD1 (in), UART_JENIC_TXD1 (out), USER_DO (out), V3P3 (in), V24P0 (in), ZG_ANA_IO (bidir)

### Nets
GND: C7.2 C8.2 C9.2 C11.2 C12.2 D6.1 D7.1 D8.2(A) D10.1 D11.1 J4.2 R22.1 R24.1 U15.4(GND)
V3P3: C7.1 L2.2 R16.2 U15.8(VCC) ; port V3P3
V3P3_JENIC: C8.1 L2.1 R19.2 ; sheet Module_blk/VDD  [project net VDD]
V24P0: R20.2 ; port V24P0
DALI_RX: port DALI_RX, sheet Module_blk/DIO8
DALI_TX: port DALI_TX, sheet Module_blk/DIO10
GPS_RESETN: port GPS_RESETN, sheet Module_blk/DIO13
GPS_TIMEMARK: port GPS_TIMEMARK, sheet Module_blk/DIO12
I2C_JENIC_SCLK: port I2C_JENIC_SCLK, sheet Module_blk/DIO16
I2C_JENIC_SDA: port I2C_JENIC_SDA, sheet Module_blk/DIO17
IRQ_I2C_DEV_L: port IRQ_I2C_DEV_L, sheet Module_blk/DIO11
JENIC_ADC1: C12.1 R23.2 R24.2 ; sheet Module_blk/ADC1
JENIC_ADC4: C11.1 R20.1 R22.2 ; sheet Module_blk/ADC2
JENIC_BLUE_LED: R18.2 ; sheet Module_blk/SSZ
JENIC_BLUE_LED_R: D6.2 R18.1
JENIC_GREEN_LED: R1.2 ; port JENIC_GREEN_LED, sheet Module_blk/SPIMOSI  [project net USER_DI]
JENIC_GREEN_LED_R: D10.2 R1.1
JENIC_JMPR: J4.1 TP5.1 ; sheet Module_blk/DIO1
JENIC_PROG_L: R19.1 U15.1(1~{OE}) U15.7(2OE) ; port JENIC_PROG_L, sheet Module_blk/SPIMISO  [project net JENIC_PROG]
JENIC_RED_LED: R17.2 ; sheet Module_blk/DIO0
JENIC_RED_LED_R: D7.2 R17.1
JENIC_RST_L: C9.1 R16.1 ; port JENIC_RST_L, sheet Module_blk/RESETN  [project net JENIC_RST]
JTAG_TCK: port JTAG_TCK, sheet Module_blk/DIO4
JTAG_TDI: R21.1 ; port JTAG_TDI, sheet Module_blk/DIO7
JTAG_TDO: U15.5(2A) ; port JTAG_TDO, sheet Module_blk/DIO6
JTAG_TMS: port JTAG_TMS, sheet Module_blk/DIO5
TB_RXD0_BUFF: D11.4 U15.2(1A) ; port TB_RXD0_BUFF
TB_TXD0_BUFF: D11.3 U15.3(2Y) ; port TB_TXD0_BUFF
UART_JENIC_RXD1: port UART_JENIC_RXD1, sheet Module_blk/DIO15
UART_JENIC_TXD1: port UART_JENIC_TXD1, sheet Module_blk/DIO14
USER_DO: port USER_DO, sheet Module_blk/DIO9
ZG_ANA_IO: D8.1(K) R23.1 ; port ZG_ANA_IO
NetR21_2: R21.2 U15.6(1Y)

Not connected (* = marked no-connect by the designer): D11 2*

### Notes on the sheet
- Fcutoff = (R1+R2)/(2*PI*R1*R2*C)
- Fcutoff = (82K+10K)/(2*PI*82K*10K*100nF) = 178.56 Hz
- Fcutoff = 1/(2*PI*R*C) = 1/(2*PI*10K*100nF) = 159 Hz
- Title:
- Sheet:
- Date:
- of
- Project:
- Revision:
- Engineer:
- Wi4B S.r.l

### Library data of the parts
C7 C9 = GRM155R71H104ME14D: as C34 on sheet i2c_dev_blk; MPN: GRM155R71H104ME14D; RATING: 50V; DNP: *
C8 = GRM31CR71C106KAC7L: as C5 on sheet gps_blk; MPN: GRM31CR71C106KAC7L; RATING: 16V; DNP: *
C11 C12 = GCM188R71H224KA64D: CAP CER 0.22UF 50V X7R 0603; MFT: Murata Electronics North America; TYPE: Surface Mount, MLCC; MPN: GCM188R71H224KA64D; RATING: 50V
D6 = VLMB1500-GS08: as D4 on sheet gps_blk; MPN: VLMB1500-GS08; TYPE: SMD; RATING: *; DNP: *
D7 = VLMS1500-GS08: LED RED 0402 SMD; MFT: Vishay Semiconductor Opto Division; MPN: VLMS1500-GS08; TYPE: SMD; RATING: *; DNP: *
D8 = SMBJ33A-TP: TVS DIODE 33VWM 53.3VC SMB; MFT: Micro Commercial Co; TYPE: Surface Mount; VALUE: SMBJ33A-TP; MPN: SMBJ33A-TP
D10 = XZVG68W-2: LED GREEN CLEAR CHIP SMD; MFT: SunLED; MPN: XZVG68W-2; RATING: *; LOAD: *; TYPE: SMD
D11 = CMP-2000-05191-1: TVS Diode Array, 30 pF, 30 KV, -40 to 85 degC, 4-Pin SOT143, RoHS, Tape and Reel; Manufacturer: Littelfuse; Direction Type: Uni-Directional; Product Height (mm): 1.05mm; Leakage Current (Max): 0.1uA; Clamping Voltage (Max): 8V; Reverse Stand-off Voltage: 5.5(Min)V; Configuration: Triple; Working Voltage: 5.5V; Product Length (mm): 3.04mm; Working Voltage (Max): 5.5V(Min); Capacitance Value: 30pF; Rad Hardened: No; Number of Elements: 3; Product Depth (mm): 1.4mm; Operating Temperature Max Deg. C: 85C; Suppressor Type: TVS; Operating Temperature Min Deg. C: -40C; Operating Temp Range: -40Cto85C; Mounting: SurfaceMount; Package / Case: SOT-143; Datasheet Version: Dec-13; Package Type: SOT-143; Packaging: TapeandReel; Pin Count: 3+Tab; Operating Temperature Classification: Industrial; Datasheet URL: https://datasheet.ciiva.com/15143/getdatasheetpartid-116020-15143550.pdf; Manufacturer URL: http://www.littelfuse.com/; Leakage Current: 0.1uA; Mounting Style: SurfaceMount; Clamping Voltage: 8V; Polarity: Uni-Directional
L2 = BLM21PG121SN1D: FERRITE CHIP 120 OHM 0805; MFT: Murata Electronics North America; RATING: 3A; TYPE: Surface Mount; VALUE: 120 Ohm; MPN: BLM21PG121SN1D
R1 R17 R18 = MCS04020C1001FE000: as R11 on sheet dali_phy_blk; MPN: MCS04020C1001FE000; TYPE: SMD; RATING: 1/10W; DNP: *
R16 = MCS04020C4701FE000: RES SMD 4.7K OHM 1% 1/10W 0402; MFT: Vishay Beyschlag; MPN: MCS04020C4701FE000; TYPE: SMD; RATING: 1/10W; DNP: *
R19 = RC0402FR-0747KL: RES SMD 47K OHM 1% 1/16W 0402; MFT: Yageo; APN: RQ-0473-R7-C; MPN: RC0402FR-0747KL; LOAD: *; TYPE: SMD; RATING: 1/16W
R20 R23 = ERA-3AEB683V: RES SMD 68K OHM 0.1% 1/10W 0603; MFT: Panasonic Electronic Components; MPN: ERA-3AEB683V; TYPE: SMD; RATING: 1/10W
  R20: LOAD: *
  R23: DNP: *
R21 = CRCW04020000Z0ED: RES SMD 0.0OHM JUMPER 1/16W 0402; MFT: Vishay Dale; RATING: 63mW; MPN: CRCW04020000Z0ED; TYPE: Surface Mount
R22 R24 = ERA-3AEB562V: RES SMD 5.6K OHM 0.1% 1/10W 0603; MFT: Panasonic Electronic Components; MPN: ERA-3AEB562V; TYPE: SMD; RATING: 1/10W
  R22: LOAD: *
  R24: DNP: *
TP5 = Test Point_2mm: Test Point 2mm
U15 = CMP-0859-00564-3: Dual Buffer/Driver With 3-State Outputs, DCT0008A, LARGE T&R; Manufacturer: Texas Instruments; 3-State Output: Yes; tpd @ Nom Voltage(Max)(ns): 8.8,4.8,4.3,3.7; Rating: Catalog; Bits(#): 2; Technology Family: LVC; Logic: True; Voltage(Nom)(V): 1.8,2.5,3.3,5; Sub-Family: Non-Inverting Buffer/Driver; ICC @ Nom Voltage(Max)(mA): 0.01; F @ Nom Voltage(Max)(Mhz): 150; Schmitt Trigger: No; VCC(Min)(V): 1.65; Output Drive (IOL/IOH)(Max)(mA): 32/-32; Input Type: CMOS/TTL; Output Type: CMOS; VCC(Max)(V): 5.5; PackageReference: DCT0008A; Generic Part Number: SN74LVC2G241; Operating Temperature Range(C): -40 to 125; DatasheetVersion: SCES210N

## Sheet Module_blk.SchDoc
size A4; Engineer: JBayalas; DocumentNumber: 10; Revision: V1.0; SheetNumber: 10; SheetTotal: 11
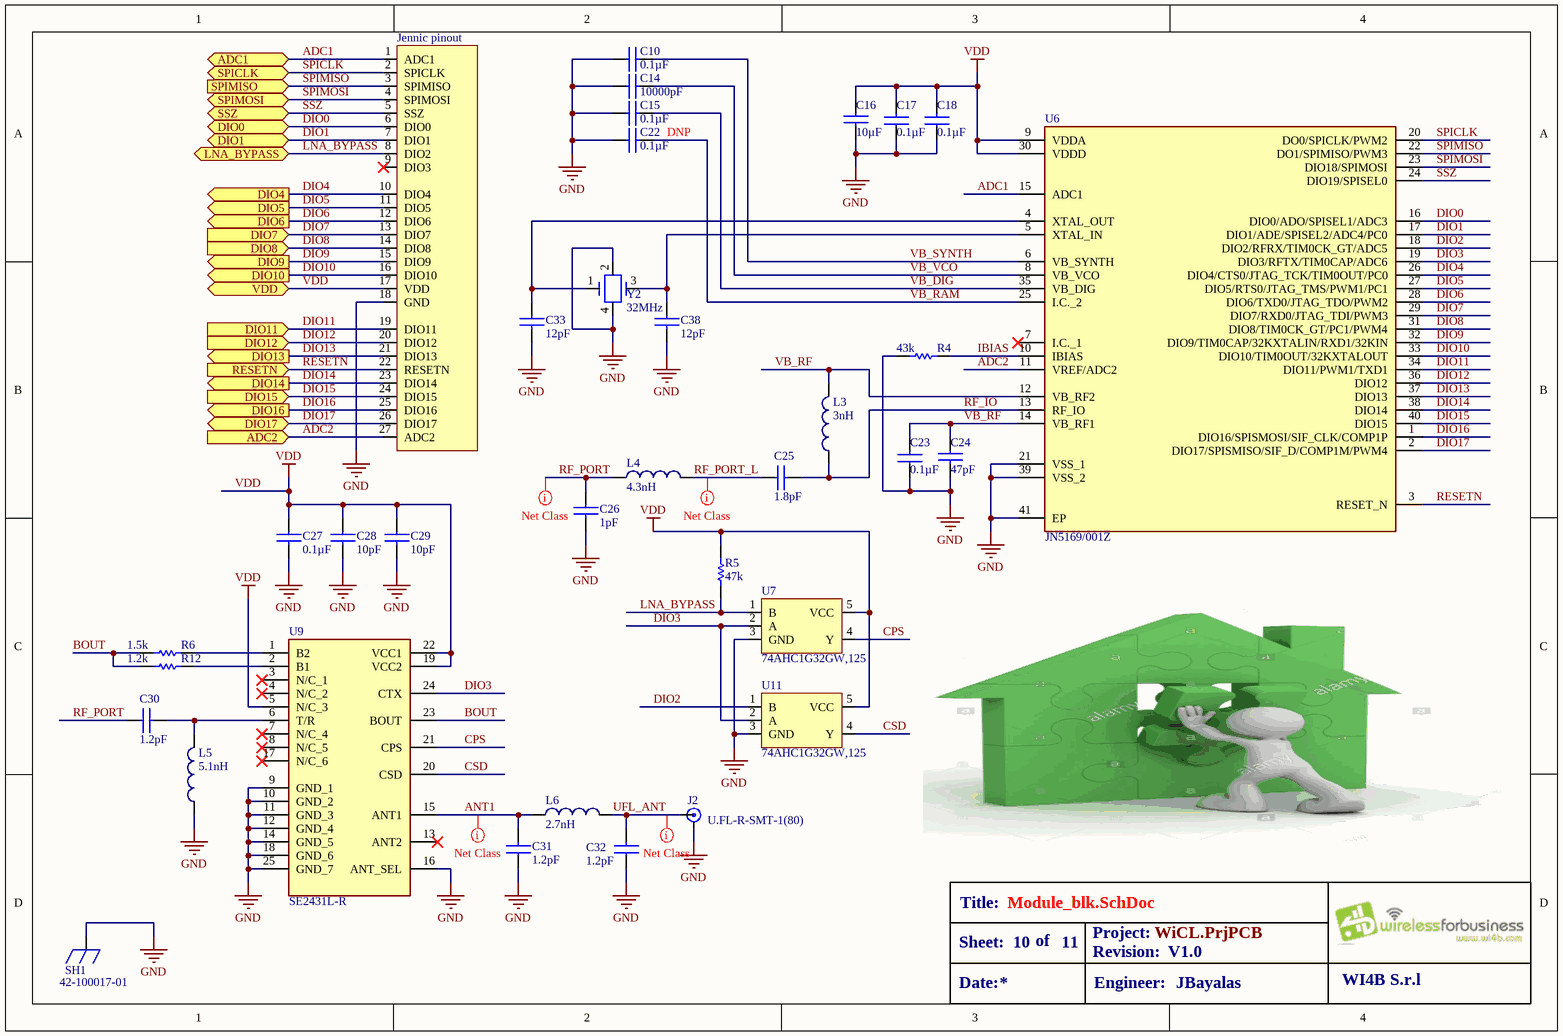
[diagram p7: Module_blk.SchDoc]

### Parts
C10  value 0.1µF  [C0402]  (hidden comment: GRM155R61A104KA01D)
C14  value 10000pF  [C0402]  (hidden comment: GRM155R71E103KA01D)
C15  value 0.1µF  [C0402]  (hidden comment: GRM155R61A104KA01D)
C16  value 10µF  [CAPC2012X135N]  (hidden comment: GRT21BR61A106KE01L)
C17  value 0.1µF  [C0402]  (hidden comment: GRM155R61A104KA01D)
C18  value 0.1µF  [C0402]  (hidden comment: GRM155R61A104KA01D)
C22  value 0.1µF  LOAD: DNP  [C0402]  (hidden comment: GRM155R61A104KA01D)
C23  value 0.1µF  [C0402]  (hidden comment: GRM155R61A104KA01D)
C24  value 47pF  [CAPC1005X55N]  (hidden comment: GRM1555C1H470JA01D)
C25  value 1.8pF  [CAPC1005X55N]  (hidden comment: GRM1555C1H1R8CA01D)
C26  value 1pF  [CAPC1005X55N]  (hidden comment: GRM1555C1H1R0CA01D)
C27  value 0.1µF  [C0402]  (hidden comment: GRM155R61A104KA01D)
C28  value 10pF  [C0402]  (hidden comment: GRM1555C1H100JA01D)
C29  value 10pF  [C0402]  (hidden comment: GRM1555C1H100JA01D)
C30  value 1.2pF  [CAPC1005X55N]  (hidden comment: GRM1555C1H1R2CA01D)
C31  value 1.2pF  [CAPC1005X55N]  (hidden comment: GRM1555C1H1R2CA01D)
C32  value 1.2pF  [CAPC1005X55N]  (hidden comment: GRM1555C1H1R2CA01D)
C33  value 12pF  [CAPC1005X55N]  (hidden comment: GRM1555C1H120JA01D)
C38  value 12pF  [CAPC1005X55N]  (hidden comment: GRM1555C1H120JA01D)
J2  U.FL-R-SMT-1(80)  [HIROSE_U.FL-R-SMT]
Jennic_pinout  Jennic pinout  [JN516X PINOUT]  (value not drawn)
L3  value 3nH  [INDC1005X45N]  (hidden comment: LQP15MN3N0B02D)
L4  value 4.3nH  [INDC1005X45N]  (hidden comment: LQP15MN4N3B02D)
L5  value 5.1nH  [INDC1005X45N]  (hidden comment: LQP15MN5N1B02D)
L6  value 2.7nH  [INDC1005X45N]  (hidden comment: LQP15MN2N7B02D)
R4  value 43k  [RESC1005X40N]  (hidden comment: RC0402FR-0743KL)
R5  value 47k  [R0402]  (hidden comment: RC0402FR-0747KL)
R6  value 1.5k  [RESC1005X40N]  (hidden comment: RC0402FR-071K5L)
R12  value 1.2k  [RESC1005X40N]  (hidden comment: RC0402FR-071K2L)
SH1  42-100017-01  [42-100017-01(Shield)]
U6  JN5169/001Z  [QFN50P600X600X100-41N]
U7  74AHC1G32GW,125  [SOT65P210X110-5N]
U9  SE2431L-R  [QFN40P300X400X90-25N-D]
U11  74AHC1G32GW,125  [SOT65P210X110-5N]
Y2  value 32MHz  [OSCCC320X250X80L75X100N]  (hidden comment: ABM8-32.000MHZ-9-D1G-T)

### Ports
ADC1 (bidir), ADC2 (in), DIO0 (bidir), DIO1 (bidir), DIO4 (out), DIO5 (out), DIO6 (out), DIO7 (in), DIO8 (in), DIO9 (out), DIO10 (out), DIO11 (in), DIO12 (in), DIO13 (out), DIO14 (out), DIO15 (in), DIO16 (out), DIO17 (bidir), LNA_BYPASS (bidir), RESETN (in), SPICLK (bidir), SPIMISO (in), SPIMOSI (bidir), SSZ (bidir), VDD (bidir)

### Nets
GND: C10.1 C14.1 C15.1 C16.2 C17.1 C18.1 C22.1 C23.1 C24.2 C26.2 C27.2 C28.2 C29.2 C31.1 C32.1 C33.2 C38.2 J2.2(GND) Jennic_pinout.18(GND) L5.2 R4.1 SH1.1 U6.21(VSS_1) U6.39(VSS_2) U6.41(EP) U7.3(GND) U9.9(GND_1) U9.10(GND_2) U9.11(GND_3) U9.12(GND_4) U9.14(GND_5) U9.16(ANT_SEL) U9.18(GND_6) U9.25(GND_7) U11.3(GND) Y2.2 Y2.4
VDD: C16.1 C17.2 C18.2 C27.1 C28.1 C29.1 Jennic_pinout.17(VDD) R5.2 U6.9(VDDA) U6.30(VDDD) U7.5(VCC) U9.5(N/C_3) U9.19(VCC2) U9.22(VCC1) U11.5(VCC) ; port VDD
ADC1: Jennic_pinout.1(ADC1) U6.15(ADC1) ; port ADC1  [project net JENIC_ADC1]
ADC2: Jennic_pinout.27(ADC2) U6.11(VREF/ADC2) ; port ADC2  [project net JENIC_ADC4]
ANT1: C31.2 L6.2 U9.15(ANT1)
BOUT: R6.1 R12.1 U9.23(BOUT)
CPS: U7.4(Y) U9.21(CPS)
CSD: U9.20(CSD) U11.4(Y)
DIO0: Jennic_pinout.6(DIO0) U6.16(DIO0/ADO/SPISEL1/ADC3) ; port DIO0  [project net JENIC_RED_LED]
DIO1: Jennic_pinout.7(DIO1) U6.17(DIO1/ADE/SPISEL2/ADC4/PC0) ; port DIO1  [project net JENIC_JMPR]
DIO2: U6.18(DIO2/RFRX/TIM0CK_GT/ADC5) U11.1(B)
DIO3: U6.19(DIO3/RFTX/TIM0CAP/ADC6) U7.2(A) U9.24(CTX) U11.2(A)
DIO4: Jennic_pinout.10(DIO4) U6.26(DIO4/CTS0/JTAG_TCK/TIM0OUT/PC0) ; port DIO4  [project net JTAG_TCK]
DIO5: Jennic_pinout.11(DIO5) U6.27(DIO5/RTS0/JTAG_TMS/PWM1/PC1) ; port DIO5  [project net JTAG_TMS]
DIO6: Jennic_pinout.12(DIO6) U6.28(DIO6/TXD0/JTAG_TDO/PWM2) ; port DIO6  [project net JTAG_TDO]
DIO7: Jennic_pinout.13(DIO7) U6.29(DIO7/RXD0/JTAG_TDI/PWM3) ; port DIO7  [project net JTAG_TDI]
DIO8: Jennic_pinout.14(DIO8) U6.31(DIO8/TIM0CK_GT/PC1/PWM4) ; port DIO8  [project net DALI_RX]
DIO9: Jennic_pinout.15(DIO9) U6.32(DIO9/TIM0CAP/32KXTALIN/RXD1/32KIN) ; port DIO9  [project net USER_DO]
DIO10: Jennic_pinout.16(DIO10) U6.33(DIO10/TIM0OUT/32KXTALOUT) ; port DIO10  [project net DALI_TX]
DIO11: Jennic_pinout.19(DIO11) U6.34(DIO11/PWM1/TXD1) ; port DIO11  [project net IRQ_I2C_DEV_L]
DIO12: Jennic_pinout.20(DIO12) U6.36(DIO12) ; port DIO12  [project net GPS_TIMEMARK]
DIO13: Jennic_pinout.21(DIO13) U6.37(DIO13) ; port DIO13  [project net GPS_RESETN]
DIO14: Jennic_pinout.23(DIO14) U6.38(DIO14) ; port DIO14  [project net UART_JENIC_TXD1]
DIO15: Jennic_pinout.24(DIO15) U6.40(DIO15) ; port DIO15  [project net UART_JENIC_RXD1]
DIO16: Jennic_pinout.25(DIO16) U6.1(DIO16/SPISMOSI/SIF_CLK/COMP1P) ; port DIO16  [project net I2C_JENIC_SCLK]
DIO17: Jennic_pinout.26(DIO17) U6.2(DIO17/SPISMISO/SIF_D/COMP1M/PWM4) ; port DIO17  [project net I2C_JENIC_SDA]
IBIAS: R4.2 U6.10(IBIAS)
LNA_BYPASS: Jennic_pinout.8(DIO2) R5.1 U7.1(B) ; port LNA_BYPASS
RESETN: Jennic_pinout.22(RESETN) U6.3(RESET_N) ; port RESETN  [project net JENIC_RST]
RF_IO: C25.2 L3.2 U6.13(RF_IO)
RF_PORT: C26.1 C30.1 L4.2
RF_PORT_L: C25.1 L4.1
SPICLK: Jennic_pinout.2(SPICLK) U6.20(DO0/SPICLK/PWM2) ; port SPICLK
SPIMISO: Jennic_pinout.3(SPIMISO) U6.22(DO1/SPIMISO/PWM3) ; port SPIMISO  [project net JENIC_PROG]
SPIMOSI: Jennic_pinout.4(SPIMOSI) U6.23(DIO18/SPIMOSI) ; port SPIMOSI  [project net USER_DI]
SSZ: Jennic_pinout.5(SSZ) U6.24(DIO19/SPISEL0) ; port SSZ  [project net JENIC_BLUE_LED]
UFL_ANT: C32.2 J2.1(SIGNAL) L6.1
VB_DIG: C15.2 U6.35(VB_DIG)
VB_RAM: C22.2 U6.25(I.C._2)
VB_RF: C23.2 C24.1 L3.1 U6.12(VB_RF2) U6.14(VB_RF1)
VB_SYNTH: C10.2 U6.6(VB_SYNTH)
VB_VCO: C14.2 U6.8(VB_VCO)
NetC30_2: C30.2 L5.1 U9.6(T/R)
NetC33_1: C33.1 U6.4(XTAL_OUT) Y2.1
NetC38_1: C38.1 U6.5(XTAL_IN) Y2.3
NetR6_2: R6.2 U9.1(B2)
NetR12_2: R12.2 U9.2(B1)

Not connected (* = marked no-connect by the designer): Jennic_pinout 9(DIO3)*; U6 7(I.C._1)*; U9 3(N/C_1)* 4(N/C_2)* 7(N/C_4)* 8(N/C_5)* 13(ANT2)* 17(N/C_6)*

### Layout directives
net class 50Ohms: ANT1, RF_PORT, RF_PORT_L, UFL_ANT

### Notes on the sheet
- Title:
- Sheet:
- Date:
- of
- Project:
- Revision:
- Engineer:
- WI4B S.r.l

### Library data of the parts
C10 C15 C17 C18 C22 C23 C27 = GRM155R61A104KA01D: CAP CER 0.1UF 10V 10% X5R 0402; MFT: Murata Electronics North America; TYPE: Surface Mount; MPN: GRM155R61A104KA01D; RATING: 10V
C14 = GRM155R71E103KA01D: CAP CER 10000PF 25V X7R 0402; MFT: Murata Electronics North America; TYPE: SMD; MPN: GRM155R71E103KA01D; RATING: 25V; LOAD: *
C16 = GRT21BR61A106KE01L: CAP CER 10UF 10V X5R 0805; MFT: Murata; TYPE: SMD; MPN: GRT21BR61A106KE01L; LOAD: *; RATING: 10V; APN: *
C24 = GRM1555C1H470JA01D: CAP CER 47PF 50V C0G/NP0 0402; MFT: Murata; TYPE: SMD; MPN: GRM1555C1H470JA01D; APN: *; RATING: 50V; LOAD: *
C25 = GRM1555C1H1R8CA01D: CAP CER 1.8PF 50V C0G/NP0 0402; MFT: Murata; TYPE: SMD; MPN: GRM1555C1H1R8CA01D; LOAD: *; RATING: 50V; APN: *
C26 = GRM1555C1H1R0CA01D: CAP CER 1PF 50V C0G/NP0 0402; MFT: Murata; TYPE: SMD; MPN: GRM1555C1H1R0CA01D; APN: *; LOAD: *; RATING: 50V
C28 C29 = GRM1555C1H100JA01D: CAP CER 10PF 50V 5% NP0 0402; MFT: Murata Electronics North America; TYPE: Surface Mount; MPN: GRM1555C1H100JA01D; RATING: 50V
C30-C32 = GRM1555C1H1R2CA01D: CAP CER 1.2PF 50V C0G/NP0 0402; MFT: Murata; TYPE: SMD; MPN: GRM1555C1H1R2CA01D; RATING: 50V; LOAD: *; APN: *
C33 C38 = GRM1555C1H120JA01D: CAP CER 12PF 50V C0G/NP0 0402; MFT: Murata; TYPE: SMD; MPN: GRM1555C1H120JA01D; APN: *; RATING: 50V; LOAD: *
J2 = U.FL-R-SMT-1(80): RF Connectors / Coaxial Connectors SMT MALE RECEPT AU; MFT: Hirose; APN: JX-001UFL-80; MPN: U.FL-R-SMT-1(80); RATING: *; LOAD: *; TYPE: SMD; VALUE: U.FL-R-SMT-1(80)
L3 = LQP15MN3N0B02D: FIXED IND 3NH 190MA 400 MOHM SMD; MFT: Murata; APN: LZ-00030-L7-00; MPN: LQP15MN3N0B02D; RATING: *; LOAD: *; TYPE: SMD
L4 = LQP15MN4N3B02D: FIXED IND 4.3NH 160MA 600 MOHM; MFT: Murata; APN: LZ-00431-L7-00; MPN: LQP15MN4N3B02D; RATING: *; TYPE: *; LOAD: *
L5 = LQP15MN5N1B02D: Inductor RF Chip ThFIXED IND 5.1NH 140MA 700 MOHM; MFT: Murata; TYPE: SMD; APN: LZ-00511-L7-00; MPN: LQP15MN5N1B02D; RATING: *; LOAD: *
L6 = LQP15MN2N7B02D: FIXED IND 2.7NH 220MA 300 MOHM; MFT: Murata; APN: LZ-00271-L7-00; TYPE: SMD; MPN: LQP15MN2N7B02D; RATING: *; LOAD: *
R4 = RC0402FR-0743KL: RES SMD 43K OHM 1% 1/16W 0402; MFT: Yageo; APN: RQ-0433-R7-C; MPN: RC0402FR-0743KL; RATING: 1/16W; LOAD: *; TYPE: SMD
R5 = RC0402FR-0747KL: as R19 on sheet jn5169_blk; MPN: RC0402FR-0747KL; LOAD: *; TYPE: SMD; RATING: 1/16W
R6 = RC0402FR-071K5L: RES SMD 1.5K OHM 1% 1/16W 0402; MFT: Yageo; APN: RQ-0154-R7-C; MPN: RC0402FR-071K5L; TYPE: SMD; RATING: 1% 1/16W; LOAD: *
R12 = RC0402FR-071K2L: RES SMD 1.2K OHM 1% 1/16W 0402; MFT: Yageo; MPN: RC0402FR-071K2L; APN: *; RATING: 1/16W; LOAD: *; TYPE: SMD
SH1 = 42-100017-01: Shield; MFT: TSC; APN: *; RATING: *; LOAD: *; TYPE: SMD; MPN: 42-100017-01; VALUE: 42-100017-01
U6 = JN5169/001Z: IC RF TXRX+MCU 802.15.4 40-VFQFN; MFT: NXP Semiconductors; APN: U8-JN5169-X1-01; MPN: JN5169/001Z; LOAD: *; TYPE: SMD; RATING: *; VALUE: JN5169/001Z
U7 U11 = 74AHC1G32GW,125: IC GATE OR 1CH 2-INP 5TSSOP; MFT: Nexperia; APN: UE-74AHC1G32-X1; MPN: 74AHC1G32GW,125; LOAD: *; TYPE: SMD; RATING: *; VALUE: 74AHC1G32GW,125
U9 = SE2431L-R: IC RF FRONT END MOD 2.4GHZ 24QFN; MFT: Skyworks; APN: U8-SE2431L-X1; MPN: SE2431L-R; RATING: *; TYPE: SMD; LOAD: *; VALUE: SE2431L-R
Y2 = ABM8-32.000MHZ-9-D1G-T: CRYSTAL 32.0000MHZ 9PF SMD; MFT: Abracon; APN: XZ-00326FH; MPN: ABM8-32.000MHZ-9-D1G-T; RATING: *; LOAD: *; TYPE: SMD

## Sheet rtc_blk.SchDoc
size A4; Engineer: JBayalas; DocumentNumber: 8; Revision: V1.0; SheetNumber: 8; SheetTotal: 11
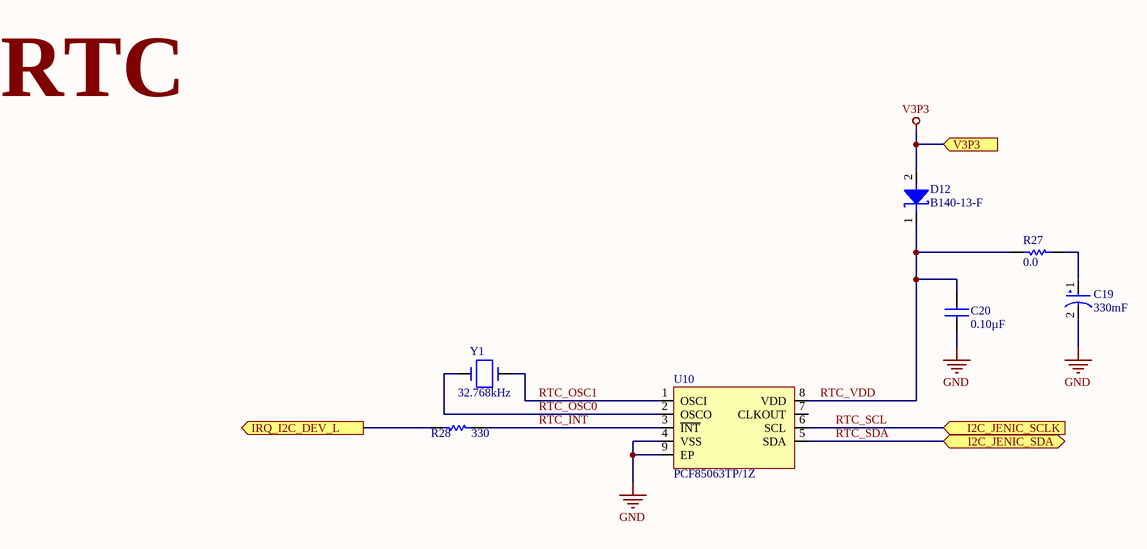
[diagram p8: rtc_blk.SchDoc]

### Parts
C19  value 330mF  [ELNA_DSK-3R3H334T-HL]  (hidden comment: DSK-3R3H334T-HL)
C20  value 0.10µF  [C0402]  (hidden comment: GRM155R71H104ME14D)
D12  value B140-13-F  [DO-214AC, SMA]  (hidden comment: *)
R27  value 0.0  [R0402]  (hidden comment: *)
R28  value 330  [R0402]  (hidden comment: CRCW0402330RFKED)
U10  PCF85063TP/1Z  [SON9P50_200X300X80L40X24T150N]
Y1  value 32.768kHz  [XTAL320X150X80L75X150N]  (hidden comment: FC-13532.7680KA-AG5)

### Ports
I2C_JENIC_SCLK (in), I2C_JENIC_SDA (bidir), IRQ_I2C_DEV_L (out), V3P3 (in)

### Nets
GND: C19.2 C20.2 U10.4(VSS) U10.9(EP)
V3P3: D12.2(anode) ; port V3P3
IRQ_I2C_DEV_L: R28.2 ; port IRQ_I2C_DEV_L
RTC_INT: R28.1 U10.3(~{INT})
RTC_OSC0: U10.2(OSCO) Y1.1
RTC_OSC1: U10.1(OSCI) Y1.2
RTC_SCL: U10.6(SCL) ; port I2C_JENIC_SCLK  [project net I2C_JENIC_SCLK]
RTC_SDA: U10.5(SDA) ; port I2C_JENIC_SDA  [project net I2C_JENIC_SDA]
RTC_VDD: C20.1 D12.1(cathode) R27.1 U10.8(VDD)
NetC19_1: C19.1 R27.2

Not connected (* = marked no-connect by the designer): U10 7(CLKOUT)

### Notes on the sheet
- RTC
- Title:
- Sheet:
- Date:
- of
- Project:
- Revision:
- Engineer:
- WI4B S.r.l

### Library data of the parts
C19 = DSK-3R3H334T-HL: CAP 330MF -20% +80% 3.3V SMD; MFT: Elna; APN: CY-330M33A-X1-Z; MPN: DSK-3R3H334T-HL; RATING: 3.3V; LOAD: *; TYPE: SMD
C20 = GRM155R71H104ME14D: as C34 on sheet i2c_dev_blk; MPN: GRM155R71H104ME14D; RATING: 50V; DNP: *
D12 = B140-13-F: as D2 on sheet power_supply_blk; MPN: B140-13-F; RATING: 40V; LOAD: *
R27 = CRCW04020000Z0ED: as R21 on sheet jn5169_blk; MPN: CRCW04020000Z0ED; TYPE: Surface Mount
R28 = CRCW0402330RFKED: as R9 on sheet dali_phy_blk; MPN: CRCW0402330RFKED; TYPE: SMD; RATING: 1/16W; LOAD: *
U10 = PCF85063TP/1Z: Real Time Clock Serial 8-Pin HWSON EP; MFT: NXP Semiconductors; APN: U8-RTC-SON8; VALUE: PCF85063TP/1Z; LOAD: *; RATING: *; TYPE: SMD; MPN: PCF85063TP/1Z
Y1 = FC-13532.7680KA-AG5: CRYSTAL 32.7680 KHZ 7.0PF SMD; MFT: Epson; APN: XZ-32761GH; MPN: FC-13532.7680KA-AG5; LOAD: *; RATING: *; TYPE: SMD

## Sheet DIO_blk.SchDoc
size A4; Engineer: JBayalas; DocumentNumber: 11; Revision: V1.0; SheetNumber: 11; SheetTotal: 11
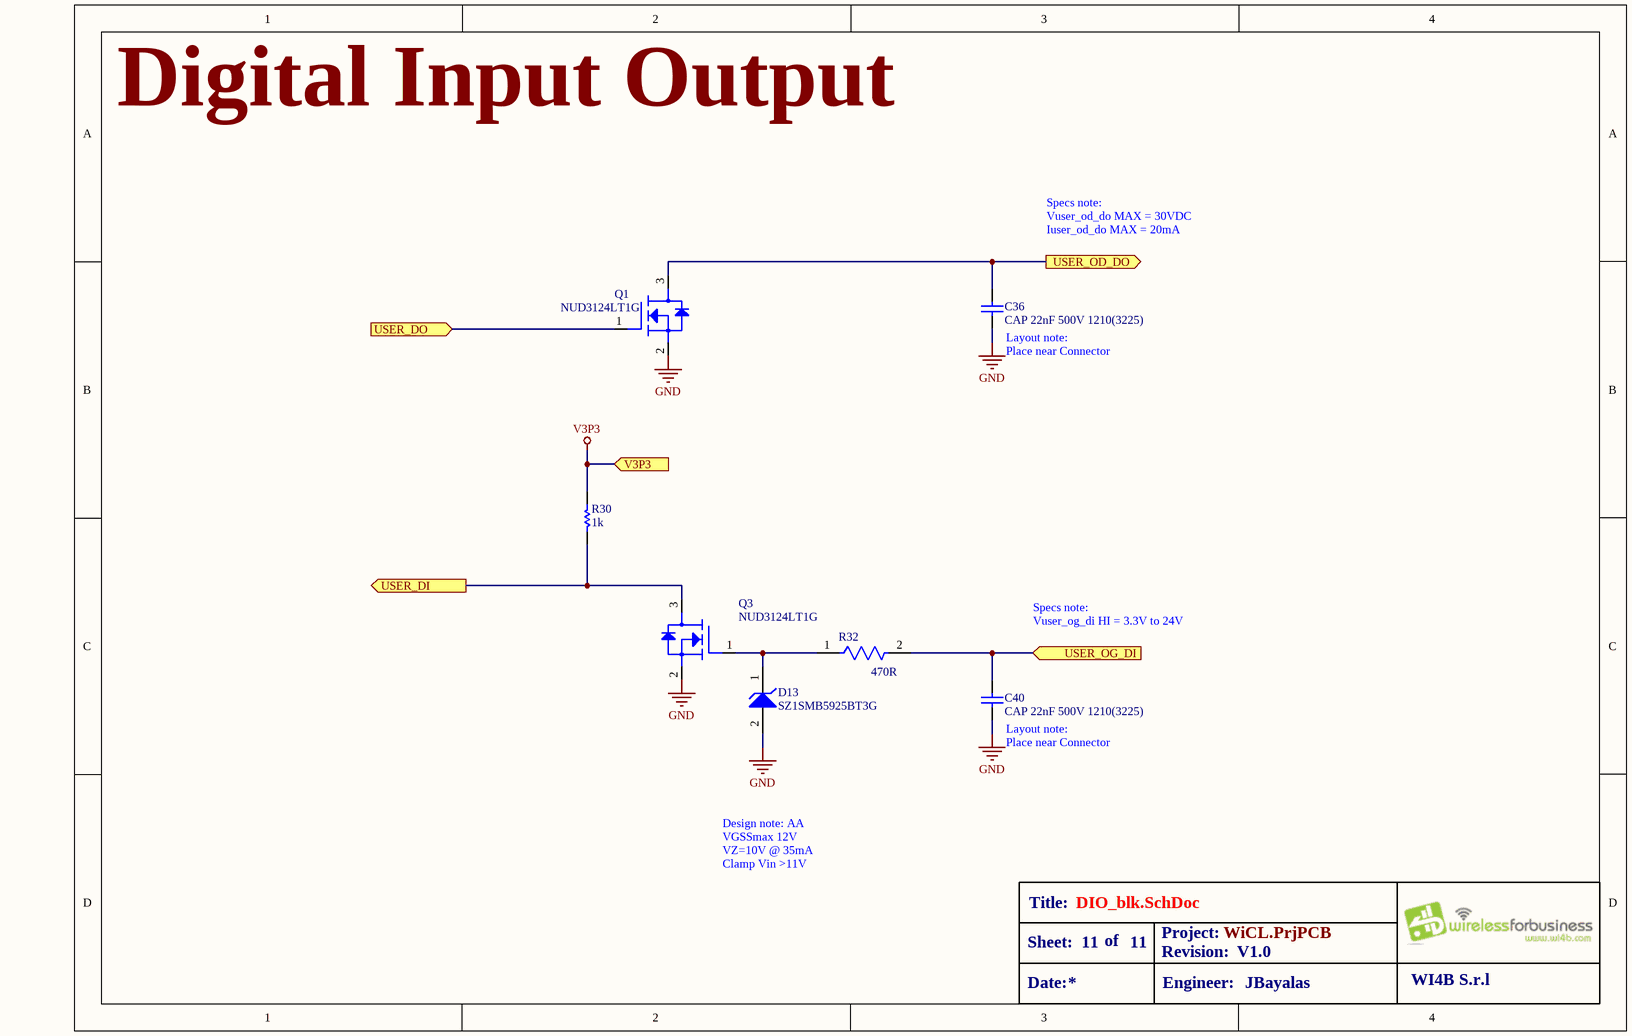
[diagram p9: DIO_blk.SchDoc]

### Parts
C36  CAP 22nF 500V 1210(3225)  [CAPC1210(3225)190_N]
C40  CAP 22nF 500V 1210(3225)  [CAPC1210(3225)190_N]
D13  SZ1SMB5925BT3G  [ONSC-SMB-2-403A-03_H_V]
Q1  NUD3124LT1G  [SOT-23-3]
Q3  NUD3124LT1G  [SOT-23-3]
R30  value 1k  [R0402]  (hidden comment: MCS04020C1001FE000)
R32  Resistance: 470R  [FP-CRCW2010-e3-MFG]  (hidden comment: CRCW2010470RJNEF)

### Ports
USER_DI (out), USER_DO (in), USER_OD_DO (out), USER_OG_DI (in), V3P3 (in)

### Nets
GND: C36.1 C40.1 D13.2(A) Q1.2(source) Q3.2(source)
V3P3: R30.2 ; port V3P3
USER_DI: Q3.3(drain) R30.1 ; port USER_DI
USER_DO: Q1.1(gate) ; port USER_DO
USER_OD_DO: C36.2 Q1.3(drain) ; port USER_OD_DO
USER_OG_DI: C40.2 R32.2 ; port USER_OG_DI
NetD13_1: D13.1(K) Q3.1(gate) R32.1

### Notes on the sheet
- Digital Input Output
- Specs note:
  Vuser_od_do MAX = 30VDC
  Iuser_od_do MAX = 20mA
- (near C36) Layout note:
  Place near Connector
- Specs note:
  Vuser_og_di HI = 3.3V to 24V
- (near C40) Layout note:
  Place near Connector
- Design note: AA
  VGSSmax 12V
  VZ=10V @ 35mA
  Clamp Vin >11V
- Title:
- Sheet:
- Date:
- of
- Project:
- Revision:
- Engineer:
- WI4B S.r.l

### Library data of the parts
C36 C40 = CMP-1038-01323-1: CAP 22nF 500V ±10% 1210 (3225 Metric) Thickness 1.9mm SMD; Case-EIA: 1210; Tolerance: Â±10%; Case-Metric: 3225; Rated Voltage: 500 V; Technology: SMT; Value: 22nF; Max Thickness: 1.9 mm
D13 = CMP-1060-00216-1: 3 W Zener Voltage Regulator, 2-Pin SMB, Pb-Free, Tape and Reel; Manufacturer: On Semiconductor; VZ Typ (V): 10; PackageReference: SMB-2-403A-03_H; ComponentLink3Description: Package Specification; RoHS: Pb-Free; ComponentLink2Description: Datasheet; ComponentLink3URL: http://www.onsemi.com/pub_link/Collateral/1SMB5913BT3-D.PDF; PackageVersion: Rev. H, 05/2011; PackageDescription: 2-Pin Small Molded Package, J-Bend Lead, Body 4.33 x 3.625 mm; Packing: Tape and Reel; DatasheetVersion: Rev. 8; PartNumber: SZ1SMB5925BT3G; ComponentLink2URL: http://www.onsemi.com/pub_link/Collateral/1SMB5913BT3-D.PDF; ComponentLink1Description: Manufacturer URL; Mounting Technology: Surface Mount; ComponentLink1URL: http://www.onsemi.com/
Q1 Q3 = NUD3124LT1G: IC INDCT LOAD DRVR AUTO SOT23; MFT: ON Semiconductor; TYPE: Surface Mount; FUNCTION: PWM OUT; VALUE: NUD3124LT1G; MPN: NUD3124LT1G
R30 = MCS04020C1001FE000: as R11 on sheet dali_phy_blk; MPN: MCS04020C1001FE000; TYPE: SMD; RATING: 1/10W; DNP: *
R32 = CMP-02407-006305-1: RES Thick Film, 470Ω, 5%, 0.75W, 200ppm/°C, 2010; Max Power Dissipation: 750mW; Voltage Rating: 400V; Package Quantity: 4000; Max Operating Temperature: 155°C; Min Operating Temperature: -55°C; Military Standard: Not; Length: 5mm; Radiation Hardening: No; Features: Automotive AEC-Q200; Contact Plating: Tin; Case Code (Imperial): 2010; Width: 0.098inch; Composition: Thick Film; Lead Free: Lead Free; Depth: 2.5mm; Case/Package: 2010; Packaging: Tape and Reel; Case Code (Metric): 5025; Mount: Surface Mount; Tolerance: 5%; Temperature Coefficient: 200ppm/°C; Power Rating: 750mW; Voltage Rating (DC): 400V; Weight: 0.001372oz; Height: 0.6mm; Termination: SMD/SMT; Number of Terminations: 2

## Sheet a3_revision_history.SchDoc
size A4; Date: 10/27/2015; Engineer: JBayalas; DocumentNumber: 2; Revision: V1.0; SheetNumber: 2; SheetTotal: 11
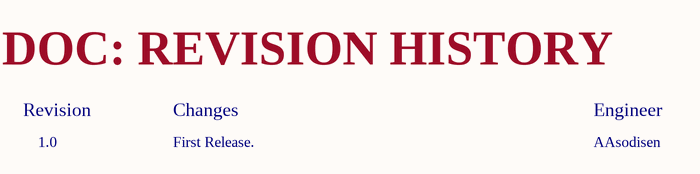
[diagram p10: a3_revision_history.SchDoc]

### Notes on the sheet
- DOC: REVISION HISTORY
- Revision
- 1.0
- Changes
- First Release.
- Engineer
- AAsodisen
- Title:
- Sheet:
- Date:
- of
- Project:
- Revision:
- Engineer:
- Wi4B S.r.l

## Nets that join several sheets
GND: a4_top_dsn (10 pins), dali_phy_blk (6 pins), power_supply_blk (8 pins), i2c_dev_blk (9 pins), gps_blk (20 pins), jn5169_blk (14 pins), Module_blk (37 pins), rtc_blk (C19.2 C20.2 U10.4 U10.9), DIO_blk (5 pins)
V3P3: a4_top_dsn (5 pins), dali_phy_blk (R8.2 U4.1), power_supply_blk (5 pins), i2c_dev_blk (14 pins), gps_blk (5 pins), jn5169_blk (C7.1 L2.2 R16.2 U15.8), rtc_blk (D12.2), DIO_blk (R30.2)
V24P0: a4_top_dsn (D1.1 P107.1 P107.2 TP8.1), power_supply_blk (C1.1 C4.1 R29.2 U1.5), jn5169_blk (R20.2)
VDD: jn5169_blk (C8.1 L2.1 R19.2), Module_blk (15 pins)
DALI_P: a4_top_dsn (P1.3), dali_phy_blk (D3.3 Q2.2 T2.1 U4.4)
DALI_RX: a4_top_dsn (TP6.1), dali_phy_blk (R8.1 U3.4), Module_blk (Jennic_pinout.14 U6.31)
DALI_TX: a4_top_dsn (TP7.1), dali_phy_blk (R10.2), Module_blk (Jennic_pinout.16 U6.33)
GPS_RESETN: gps_blk (U5.23), Module_blk (Jennic_pinout.21 U6.37)
GPS_TIMEMARK: gps_blk (R14.2 U5.29), Module_blk (Jennic_pinout.20 U6.36)
I2C_JENIC_SCLK: a4_top_dsn (P105.5 TP3.1), i2c_dev_blk (R38.1 U8.6 U12.12 U14.6), Module_blk (Jennic_pinout.25 U6.1), rtc_blk (U10.6)
I2C_JENIC_SDA: a4_top_dsn (P105.6 TP4.1), i2c_dev_blk (R37.1 U8.5 U12.2 U14.5), Module_blk (Jennic_pinout.26 U6.2), rtc_blk (U10.5)
IRQ_I2C_DEV_L: i2c_dev_blk (R39.1 R40.2 R41.2), Module_blk (Jennic_pinout.19 U6.34), rtc_blk (R28.2)
JENIC_ADC1: jn5169_blk (C12.1 R23.2 R24.2), Module_blk (Jennic_pinout.1 U6.15)
JENIC_ADC4: jn5169_blk (C11.1 R20.1 R22.2), Module_blk (Jennic_pinout.27 U6.11)
JENIC_BLUE_LED: jn5169_blk (R18.2), Module_blk (Jennic_pinout.5 U6.24)
JENIC_JMPR: jn5169_blk (J4.1 TP5.1), Module_blk (Jennic_pinout.7 U6.17)
JENIC_PROG: a4_top_dsn (J1.3 TP11.1), jn5169_blk (R19.1 U15.1 U15.7), Module_blk (Jennic_pinout.3 U6.22)
JENIC_RED_LED: jn5169_blk (R17.2), Module_blk (Jennic_pinout.6 U6.16)
JENIC_RST: a4_top_dsn (J1.6 TP14.1), jn5169_blk (C9.1 R16.1), Module_blk (Jennic_pinout.22 U6.3)
JTAG_TCK: a4_top_dsn (J1.7), Module_blk (Jennic_pinout.10 U6.26)
JTAG_TDI: a4_top_dsn (J1.5 TP13.1), jn5169_blk (R21.1), Module_blk (Jennic_pinout.13 U6.29)
JTAG_TDO: a4_top_dsn (J1.4 TP12.1), jn5169_blk (U15.5), Module_blk (Jennic_pinout.12 U6.28)
JTAG_TMS: a4_top_dsn (J1.8), Module_blk (Jennic_pinout.11 U6.27)
TB_RXD0_BUFF: a4_top_dsn (P2.6), jn5169_blk (D11.4 U15.2)
TB_TXD0_BUFF: a4_top_dsn (P2.5), jn5169_blk (D11.3 U15.3)
UART_JENIC_RXD1: a4_top_dsn (J1.11 P105.3), gps_blk (U5.25), Module_blk (Jennic_pinout.24 U6.40)
UART_JENIC_TXD1: a4_top_dsn (J1.10 P105.1), gps_blk (U5.26), Module_blk (Jennic_pinout.23 U6.38)
USER_DI: jn5169_blk (R1.2), Module_blk (Jennic_pinout.4 U6.23), DIO_blk (Q3.3 R30.1)
USER_DO: Module_blk (Jennic_pinout.15 U6.32), DIO_blk (Q1.1)
USER_OD_DO: a4_top_dsn (P2.2), DIO_blk (C36.2 Q1.3)
USER_OG_DI: a4_top_dsn (P2.3), DIO_blk (C40.2 R32.2)
ZG_ANA_IO: a4_top_dsn (P2.1), jn5169_blk (D8.1 R23.1)

## Assembly variants
Variant of WiLamp(Proto): not fitted B1 C7 C10 C11 C12 C13 C19 C20 D1 D2 D3 D4 D5 D10 D11 FB1 P7 P8 P104 P106 Q1 Q2 R19 R21 R22 R23 R24 R25 R26 R27 R28 R29 R38 R39 R40 R41 R42 R521 U3 U4 U5 U6 X1 X2